# EAGLE board stm32H7_board_rev8_144_16 (EAGLE 6.5.0), part 1 of 2
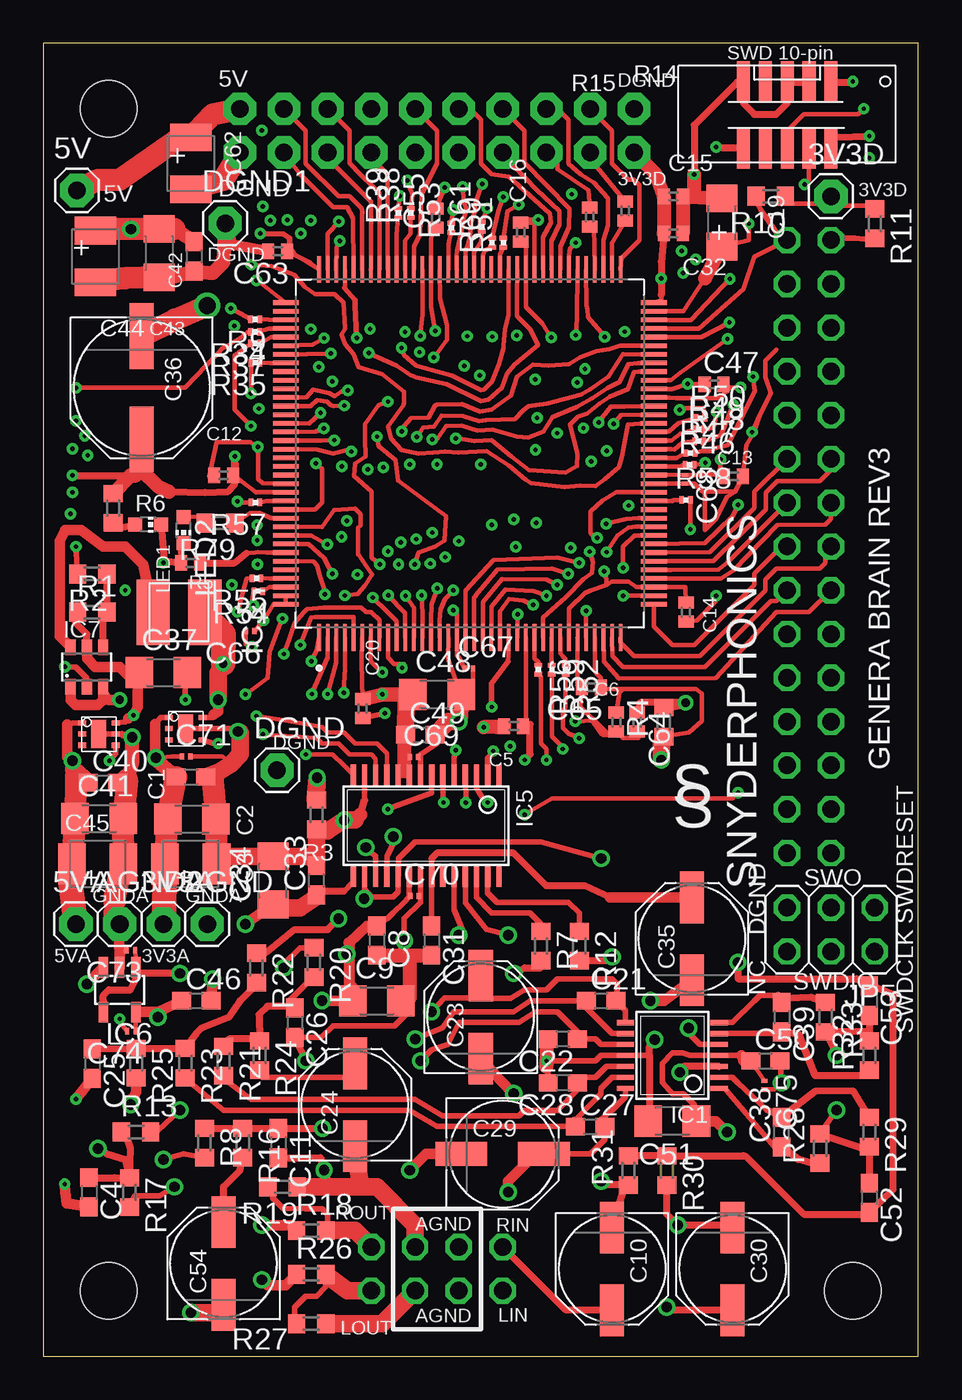
[diagram p1: board, top side]
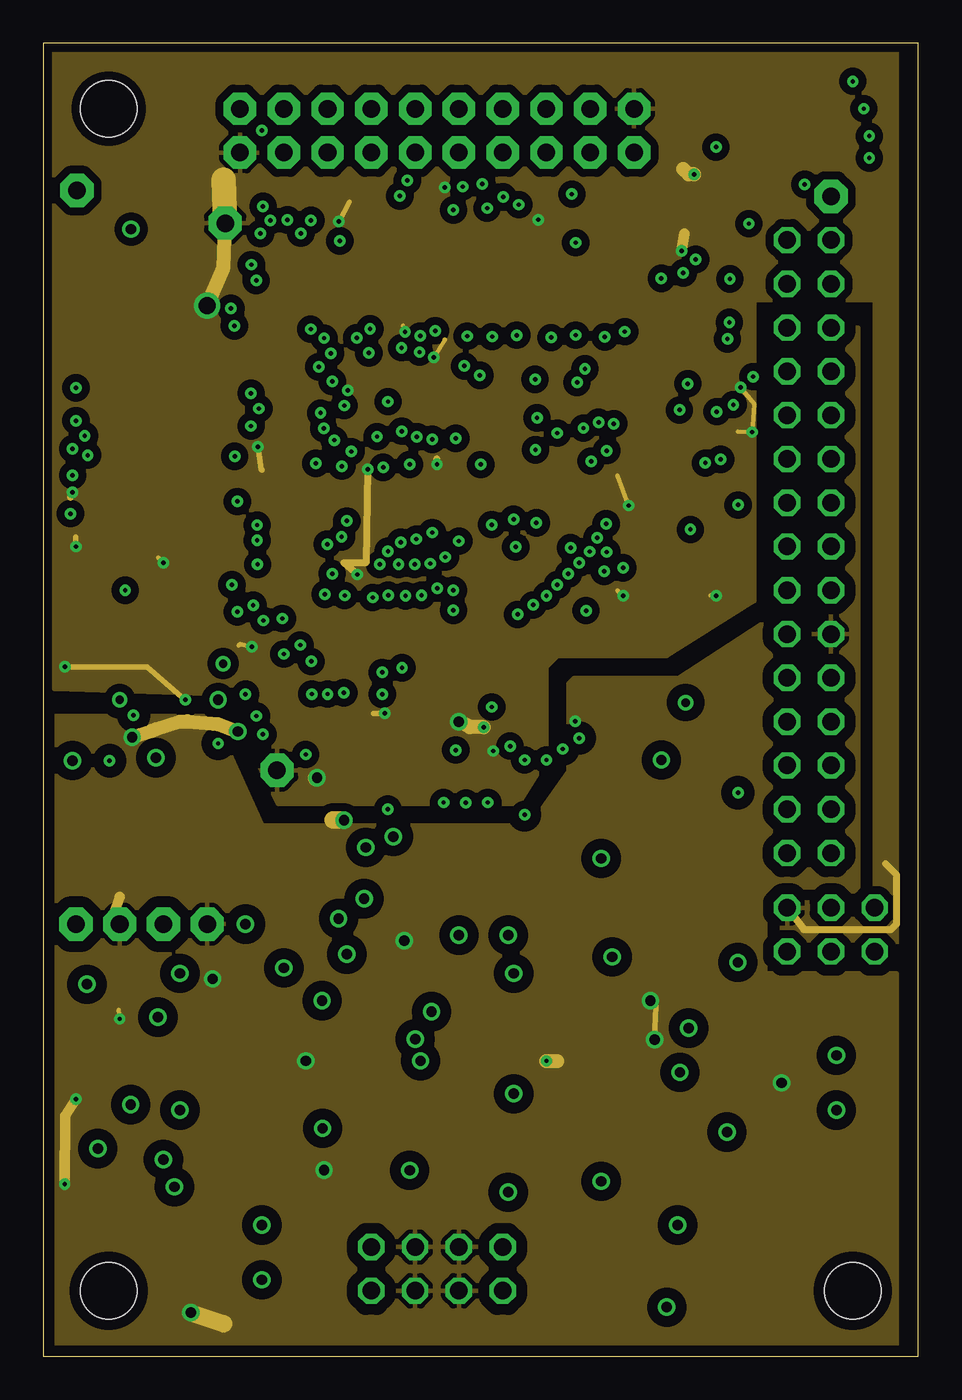
[diagram p2: board, inner layer Route2]
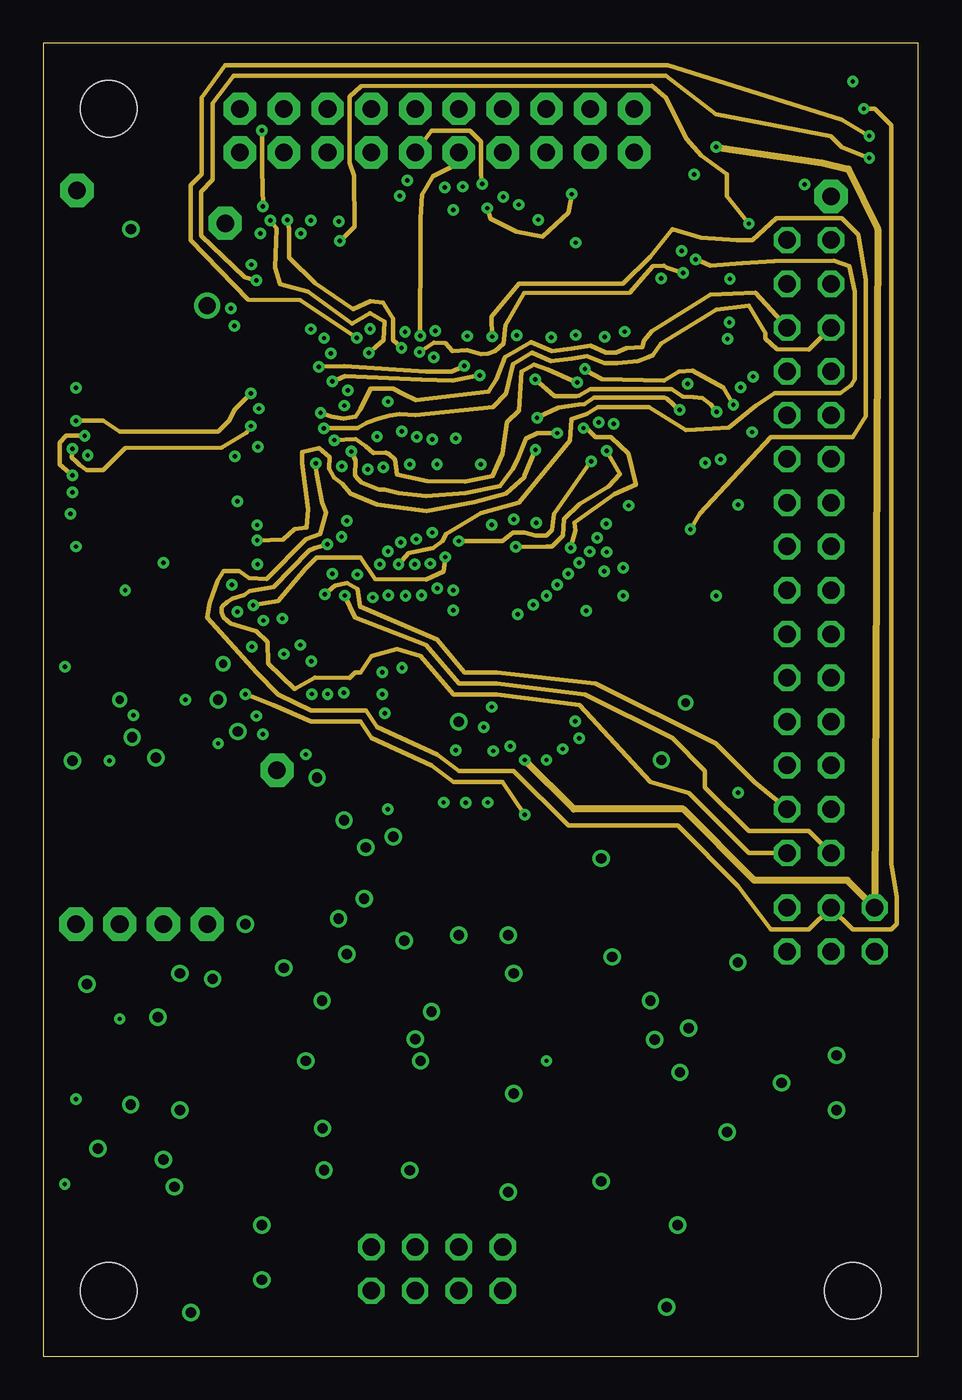
[diagram p3: board, inner layer Route3]
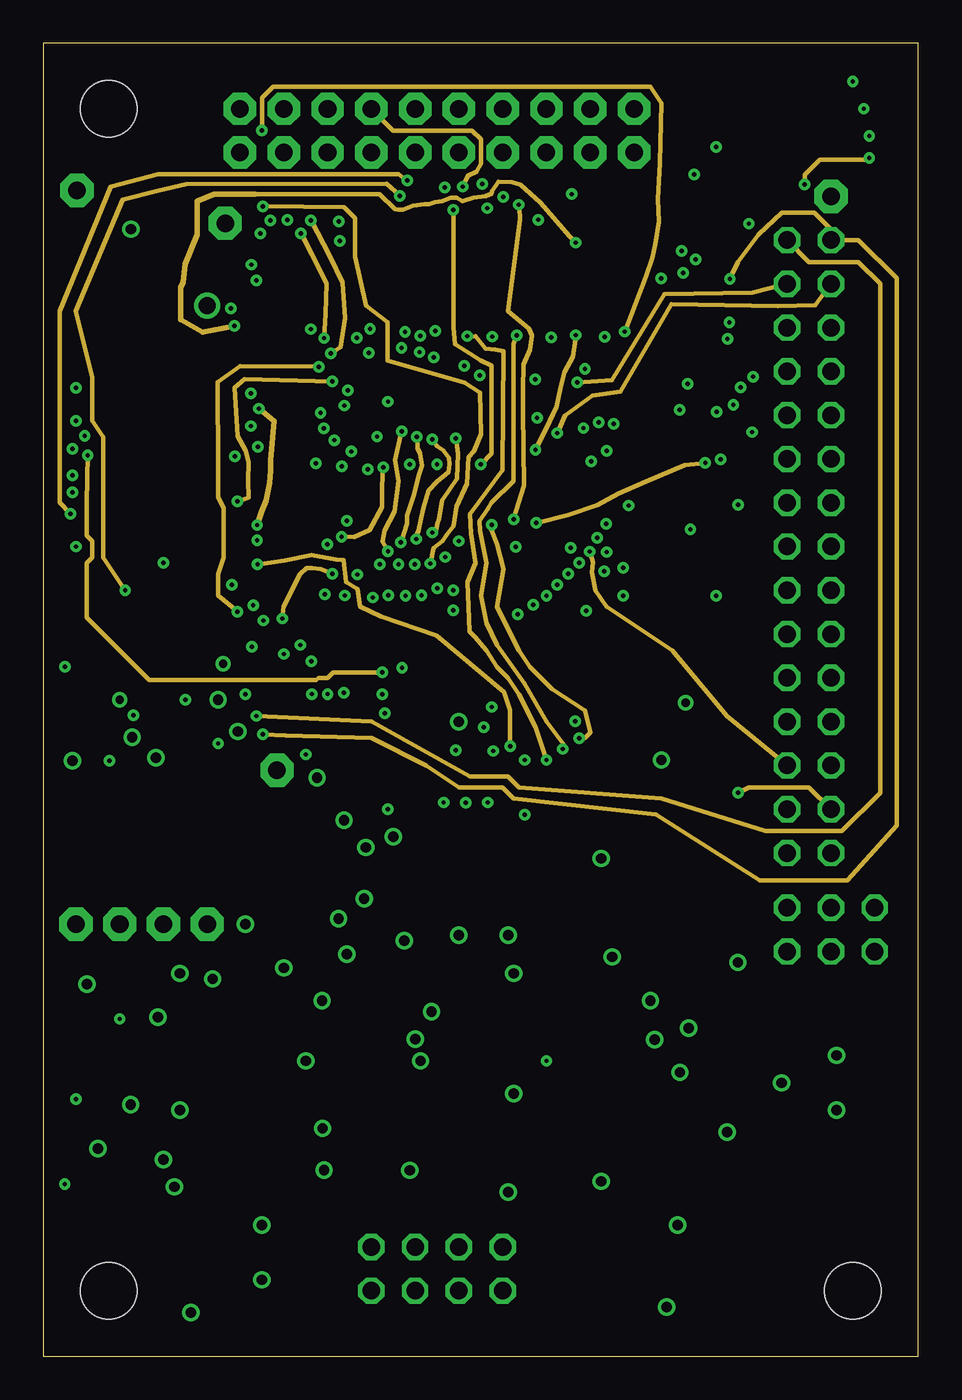
[diagram p4: board, inner layer Route14]
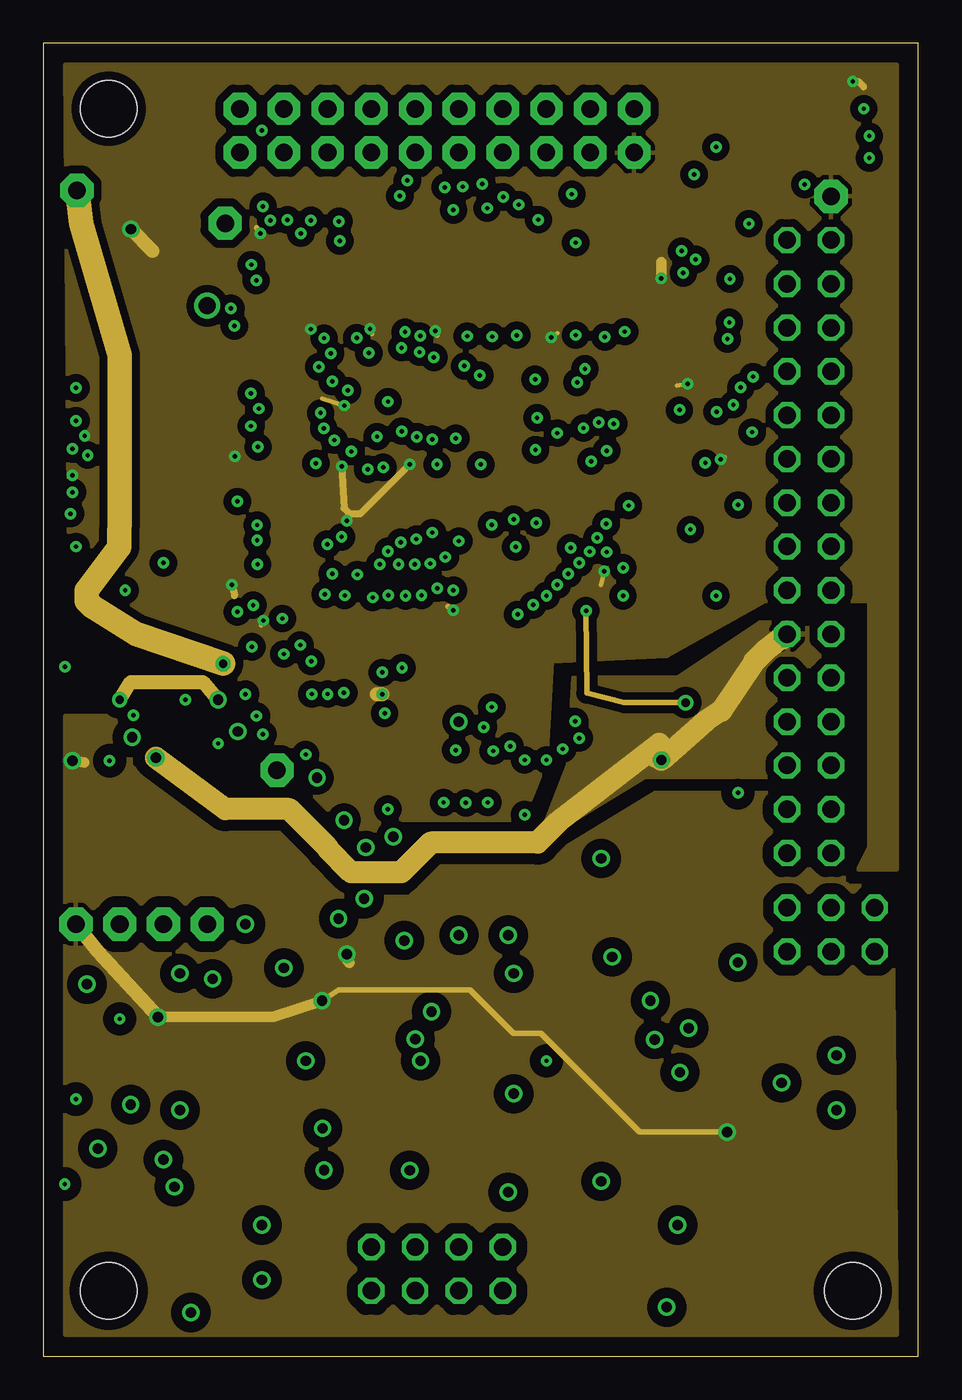
[diagram p5: board, inner layer Route15]
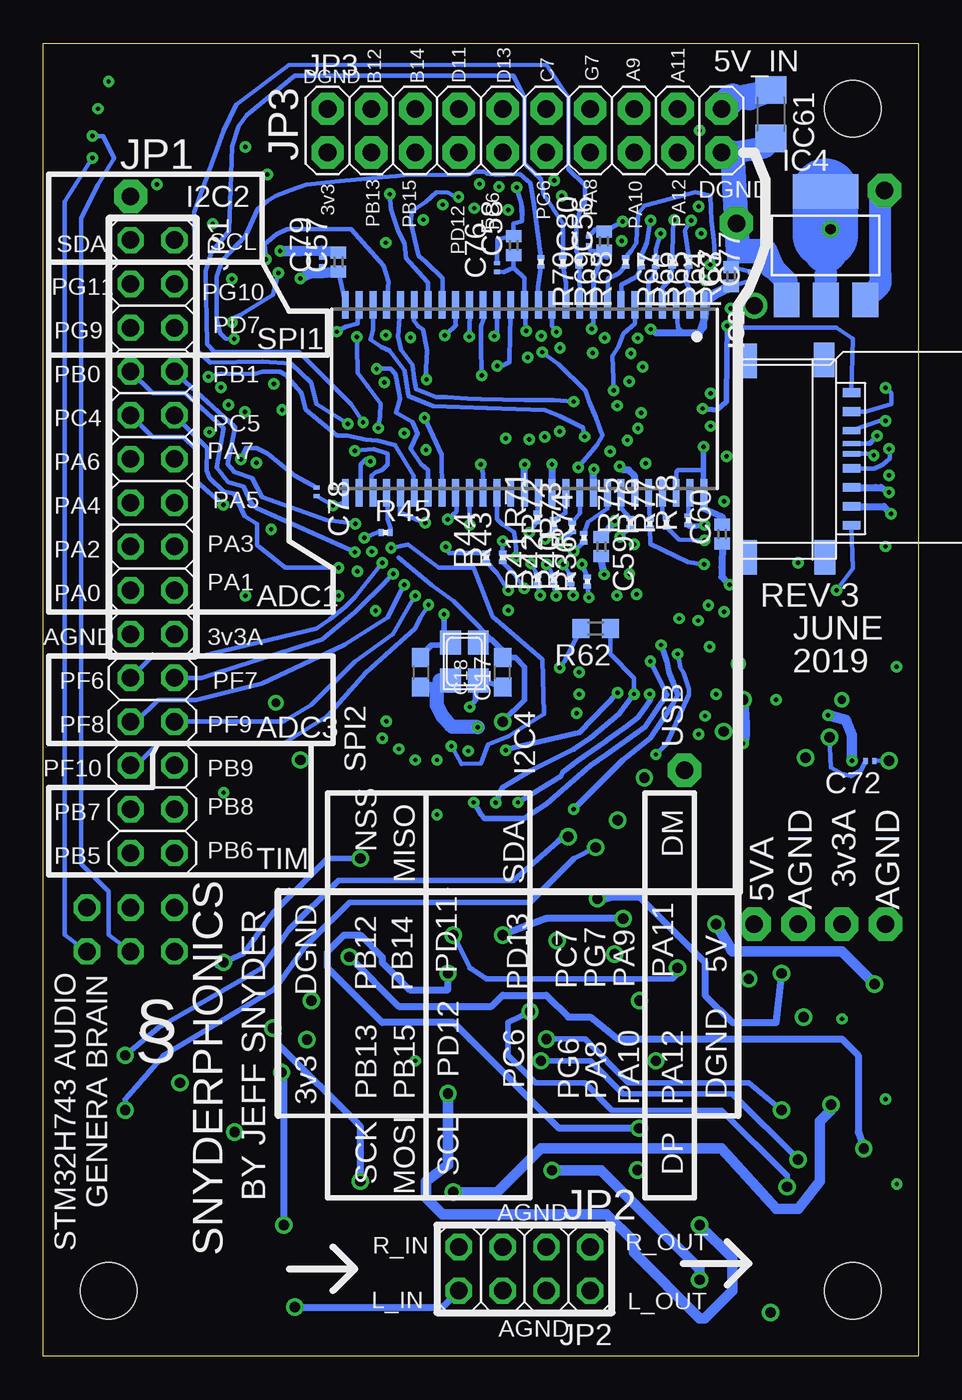
[diagram p6: board, bottom side, seen from below]

Size 50.8 x 76.2 mm. Coordinates in mm from the lower left corner, seen from the top.
Outline: 0,0 50.8,0 50.8,76.2 0,76.2 0,0
Copper layers (1+2+3*14+15+16): Top 0.035mm / dielectric 1mm / Route2 0.035mm / dielectric 1mm / Route3 0.035mm / dielectric 0.2mm / Route14 0.035mm / dielectric 0.15mm / Route15 0.035mm / dielectric 1mm / Bottom 0.035mm
Design rules "default *": minimum track width 9mil, minimum drill 9mil, track to track 9mil, track to pad 8mil, pad to pad 8mil, via to via 9mil, smd to smd 7mil, copper to edge 20mil, drill to drill 10mil, minimum pad ring 10mil, minimum via ring 8mil, stop-mask expansion 3mil, vias tented up to drill 0mil, thermal gap 10mil
Holes 3.26 mm at 3.81,72.39 46.99,3.81 3.81,3.81
Milling: 4 lines

## Footprints (pad centres in the part's own frame; a part is rotated, then mirrored left to right if it is on the bottom)
1X01 = drill 1.016 pad 1.93 octagon: 1 0,0
C0603 = smd 1.1 x 1: 1 -0.85,0; 2 0.85,0
C1206 = smd 1.6 x 1.8: 1 -1.4,0; 2 1.4,0
SMC_B = smd 1.6 x 2.4: + -1.5,0; - 1.5,0
C0402 = smd 0.7 x 0.9: 1 -0.55,0; 2 0.55,0
PANASONIC_D = smd 3 x 1.4: + 2.4,0; - -2.4,0
PANASONIC_E = smd 3.8 x 1.4: + 3,0; - -3,0
C0201 = smd 0.25 x 0.35: 1 -0.25,0; 2 0.25,0
TSSOP14 = smd 0.305 x 0.991: 1 -1.905,-2.718; 2 -1.27,-2.718; 3 -0.635,-2.718; 4 0,-2.718; 5 0.635,-2.718; 6 1.27,-2.718; 7 1.905,-2.718; 8 1.905,2.718; 9 1.27,2.718; 10 0.635,2.718; 11 0,2.718; 12 -0.635,2.718; 13 -1.27,2.718; 14 -1.905,2.718
TSOP54 = smd 0.4 x 1.6: 1 -10.4,-5.45; 2 -9.6,-5.45; 3 -8.8,-5.45; 4 -8,-5.45; 5 -7.2,-5.45; 6 -6.4,-5.45; 7 -5.6,-5.45; 8 -4.8,-5.45; 9 -4,-5.45; 10 -3.2,-5.45; 11 -2.4,-5.45; 12 -1.6,-5.45; 13 -0.8,-5.45; 14 0,-5.45; 15 0.8,-5.45; 16 1.6,-5.45; 17 2.4,-5.45; 18 3.2,-5.45; 19 4,-5.45; 20 4.8,-5.45; 21 5.6,-5.45; 22 6.4,-5.45; 23 7.2,-5.45; 24 8,-5.45; 25 8.8,-5.45; 26 9.6,-5.45; 27 10.4,-5.45; 28 10.4,5.45; 29 9.6,5.45; 30 8.8,5.45; 31 8,5.45; 32 7.2,5.45; 33 6.4,5.45; 34 5.6,5.45; 35 4.8,5.45; 36 4,5.45; 37 3.2,5.45; 38 2.4,5.45; 39 1.6,5.45; 40 0.8,5.45; 41 0,5.45; 42 -0.8,5.45; 43 -1.6,5.45; 44 -2.4,5.45; 45 -3.2,5.45; 46 -4,5.45; 47 -4.8,5.45; 48 -5.6,5.45; 49 -6.4,5.45; 50 -7.2,5.45; 51 -8,5.45; 52 -8.8,5.45; 53 -9.6,5.45; 54 -10.4,5.45
QFP50P2200X2200X160-144N = smd 1.56 x 0.28: 1 -10.68,8.75; 2 -10.68,8.25; 3 -10.68,7.75; 4 -10.68,7.25; 5 -10.68,6.75; 6 -10.68,6.25; 7 -10.68,5.75; 8 -10.68,5.25; 9 -10.68,4.75; 10 -10.68,4.25; 11 -10.68,3.75; 12 -10.68,3.25; 13 -10.68,2.75; 14 -10.68,2.25; 15 -10.68,1.75; 16 -10.68,1.25; 17 -10.68,0.75; 18 -10.68,0.25; 19 -10.68,-0.25; 20 -10.68,-0.75; 21 -10.68,-1.25; 22 -10.68,-1.75; 23 -10.68,-2.25; 24 -10.68,-2.75; 25 -10.68,-3.25; 26 -10.68,-3.75; 27 -10.68,-4.25; 28 -10.68,-4.75; 29 -10.68,-5.25; 30 -10.68,-5.75; 31 -10.68,-6.25; 32 -10.68,-6.75; 33 -10.68,-7.25; 34 -10.68,-7.75; 35 -10.68,-8.25; 36 -10.68,-8.75; 73 10.68,-8.75; 74 10.68,-8.25; 75 10.68,-7.75; 76 10.68,-7.25; 77 10.68,-6.75; 78 10.68,-6.25; 79 10.68,-5.75; 80 10.68,-5.25; 81 10.68,-4.75; 82 10.68,-4.25; 83 10.68,-3.75; 84 10.68,-3.25; 85 10.68,-2.75; 86 10.68,-2.25; 87 10.68,-1.75; 88 10.68,-1.25; 89 10.68,-0.75; 90 10.68,-0.25; 91 10.68,0.25; 92 10.68,0.75; 93 10.68,1.25; 94 10.68,1.75; 95 10.68,2.25; 96 10.68,2.75; 97 10.68,3.25; 98 10.68,3.75; 99 10.68,4.25; 100 10.68,4.75; 101 10.68,5.25; 102 10.68,5.75; 103 10.68,6.25; 104 10.68,6.75; 105 10.68,7.25; 106 10.68,7.75; 107 10.68,8.25; 108 10.68,8.75 | smd 0.28 x 1.56: 37 -8.75,-10.68; 38 -8.25,-10.68; 39 -7.75,-10.68; 40 -7.25,-10.68; 41 -6.75,-10.68; 42 -6.25,-10.68; 43 -5.75,-10.68; 44 -5.25,-10.68; 45 -4.75,-10.68; 46 -4.25,-10.68; 47 -3.75,-10.68; 48 -3.25,-10.68; 49 -2.75,-10.68; 50 -2.25,-10.68; 51 -1.75,-10.68; 52 -1.25,-10.68; 53 -0.75,-10.68; 54 -0.25,-10.68; 55 0.25,-10.68; 56 0.75,-10.68; 57 1.25,-10.68; 58 1.75,-10.68; 59 2.25,-10.68; 60 2.75,-10.68; 61 3.25,-10.68; 62 3.75,-10.68; 63 4.25,-10.68; 64 4.75,-10.68; 65 5.25,-10.68; 66 5.75,-10.68; 67 6.25,-10.68; 68 6.75,-10.68; 69 7.25,-10.68; 70 7.75,-10.68; 71 8.25,-10.68; 72 8.75,-10.68; 109 8.75,10.68; 110 8.25,10.68; 111 7.75,10.68; 112 7.25,10.68; 113 6.75,10.68; 114 6.25,10.68; 115 5.75,10.68; 116 5.25,10.68; 117 4.75,10.68; 118 4.25,10.68; 119 3.75,10.68; 120 3.25,10.68; 121 2.75,10.68; 122 2.25,10.68; 123 1.75,10.68; 124 1.25,10.68; 125 0.75,10.68; 126 0.25,10.68; 127 -0.25,10.68; 128 -0.75,10.68; 129 -1.25,10.68; 130 -1.75,10.68; 131 -2.25,10.68; 132 -2.75,10.68; 133 -3.25,10.68; 134 -3.75,10.68; 135 -4.25,10.68; 136 -4.75,10.68; 137 -5.25,10.68; 138 -5.75,10.68; 139 -6.25,10.68; 140 -6.75,10.68; 141 -7.25,10.68; 142 -7.75,10.68; 143 -8.25,10.68; 144 -8.75,10.68
SOT223 = smd 1.499 x 2.007: 1 -2.261,-3.15; 2 0.025,-3.15; 3 2.311,-3.15 | smd 3.81 x 2.007: PAD 0,3.15
TSSOP28 = smd 0.305 x 1.27: 1 -4.225,-2.918; 2 -3.575,-2.918; 3 -2.925,-2.918; 4 -2.275,-2.918; 5 -1.625,-2.918; 6 -0.975,-2.918; 7 -0.325,-2.918; 8 0.325,-2.918; 9 0.975,-2.918; 10 1.625,-2.918; 11 2.275,-2.918; 12 2.925,-2.918; 13 3.575,-2.918; 14 4.225,-2.918; 15 4.225,2.918; 16 3.575,2.918; 17 2.925,2.918; 18 2.275,2.918; 19 1.625,2.918; 20 0.975,2.918; 21 0.325,2.918; 22 -0.325,2.918; 23 -0.975,2.918; 24 -1.625,2.918; 25 -2.275,2.918; 26 -2.925,2.918; 27 -3.575,2.918; 28 -4.225,2.918
SOT23-5L = smd 0.55 x 1.2: 1 -0.95,-1.3; 2 0,-1.3; 3 0.95,-1.3; 4 0.95,1.3; 5 -0.95,1.3
SOT23-6 = smd 0.6 x 0.9: 1 -0.95,-1.15; 2 0,-1.15; 3 0.95,-1.15; 4 0.95,1.15; 5 0,1.15; 6 -0.95,1.15
6-WSON = smd 0.45 x 0.3: 1 -0.975,0.65; 2 -0.975,0; 3 -0.975,-0.65; 4 0.975,-0.65; 5 0.975,0; 6 0.975,0.65 | smd 0.9 x 1.6: PAD 0,0
2X15 = drill 1.016 octagon: 1 -17.78,-1.27; 2 -17.78,1.27; 3 -15.24,-1.27; 4 -15.24,1.27; 5 -12.7,-1.27; 6 -12.7,1.27; 7 -10.16,-1.27; 8 -10.16,1.27; 9 -7.62,-1.27; 10 -7.62,1.27; 11 -5.08,-1.27; 12 -5.08,1.27; 13 -2.54,-1.27; 14 -2.54,1.27; 15 0,-1.27; 16 0,1.27; 17 2.54,-1.27; 18 2.54,1.27; 19 5.08,-1.27; 20 5.08,1.27; 21 7.62,-1.27; 22 7.62,1.27; 23 10.16,-1.27; 24 10.16,1.27; 25 12.7,-1.27; 26 12.7,1.27; 27 15.24,-1.27; 28 15.24,1.27; 29 17.78,-1.27; 30 17.78,1.27
2X04 = drill 1.016 octagon: 1 -3.81,-1.27; 2 -3.81,1.27; 3 -1.27,-1.27; 4 -1.27,1.27; 5 1.27,-1.27; 6 1.27,1.27; 7 3.81,-1.27; 8 3.81,1.27
2X10 = drill 1.016 pad 1.88 octagon: 1 -11.43,-1.27; 2 -11.43,1.27; 3 -8.89,-1.27; 4 -8.89,1.27; 5 -6.35,-1.27; 6 -6.35,1.27; 7 -3.81,-1.27; 8 -3.81,1.27; 9 -1.27,-1.27; 10 -1.27,1.27; 11 1.27,-1.27; 12 1.27,1.27; 13 3.81,-1.27; 14 3.81,1.27; 15 6.35,-1.27; 16 6.35,1.27; 17 8.89,-1.27; 18 8.89,1.27; 19 11.43,-1.27; 20 11.43,1.27
2X03 = drill 1.016 octagon: 1 -2.54,-1.27; 2 -2.54,1.27; 3 0,-1.27; 4 0,1.27; 5 2.54,-1.27; 6 2.54,1.27
1212 = smd 1.93 x 3.81: P$1 1.5,0; P$2 -1.5,0
CHIP-LED0603 = smd 0.8 x 0.8: A 0,-0.75; C 0,0.75
NX3225 = smd 1.4 x 1.2: 1 -1.1,-0.8; 2 1.1,-0.8; 3 1.1,0.8; 4 -1.1,0.8
R0603 = smd 1 x 1.1: 1 -0.85,0; 2 0.85,0
R0402 = smd 0.7 x 0.9: 1 -0.55,0; 2 0.55,0
R0201 = smd 0.28 x 0.43: 1 -0.255,0; 2 0.255,0
1050270001 = smd 0.5 x 1: P1 3.85,-3.1; P2 2.75,-3.1; P5 -0.55,-3.1; P6 -1.65,-3.1; P7 -2.75,-3.1; P8 -3.85,-3.1 | smd 0.4 x 1: P3 1.65,-3.1 | smd 0.3 x 1: P4 0.9,-3.1; SWITCH 0.3,-3.1 | smd 2 x 1.2: P$1 5.7,3; P$2 -5.7,3; P$3 -5.7,-1.55; P$4 5.75,-1.5
3221-10-0300-00 = smd 0.76 x 2.4: 1 -2.54,-1.87; 2 -2.54,1.97; 3 -1.27,-1.87; 4 -1.27,1.97; 5 0,-1.87; 6 0,1.97; 7 1.27,-1.87; 8 1.27,1.97; 9 2.54,-1.87; 10 2.54,1.97

## Placement (x,y rotation side)
3V3A  [1X01]  6.99,25.08 0 top
3V3D  [1X01]  45.72,67.31 0 top
5V  [1X01]  1.97,67.65 0 top
5VA  [1X01]  1.91,25.08 0 top
AGND  [1X01]  9.53,25.08 0 top
AGND2  [1X01]  4.45,25.08 0 top
C1  .1uf  [C0603]  8.59,33.62 0 top
C2  1uf  [C1206]  8.64,31.18 0 top
C3  10uf  [SMC_B]  8.57,28.57 0 top
C4  2200pf  [C0603]  2.67,9.53 270 top
C5  .1uf  [C0402]  27.3,36.58 180 top
C6  .1uf  [C0402]  33.27,36.8 270 top
C7  .1uf  [C0402]  10.87,62.66 90 bottom
C8  .1uf  [C0603]  19.37,24.13 270 top
C9  1uf  [C1206]  19.37,20.64 0 top
C10  22uf  [PANASONIC_D]  33.02,5.08 270 top
C11  6.8nf  [C0603]  13.65,12.38 270 top
C12  .1uf  [C0402]  10.48,51.12 180 top
C13  .1uf  [C0402]  40.06,51.07 0 top
C14  .1uf  [C0402]  37.31,43.18 270 top
C15  .1uf  [C0402]  36.58,67.31 0 top
C16  .1uf  [C0402]  27.71,65.23 90 top
C17  18pf  [C0603]  24.13,39.69 90 bottom
C18  18pf  [C0603]  28.89,39.69 270 bottom
C19  2.2uf  [C1206]  39.4,65.79 90 top
C20  .1uf  [C0402]  18.54,37.59 270 top
C21  470pf  [C0603]  32.38,20.64 0 top
C22  1.5nf  [C0603]  30.16,18.41 180 top
C23  22uf  [PANASONIC_D]  25.4,19.68 90 top
C24  22uf  [PANASONIC_D]  18.1,14.61 90 top
C25  2200pf  [C0603]  2.86,16.99 270 top
C26  6.8nf  [C0603]  14.61,19.37 270 top
C27  470pf  [C0603]  31.75,13.34 0 top
C28  1.5nf  [C0603]  30.16,15.88 180 top
C29  22uf  [PANASONIC_D]  26.67,11.75 0 top
C30  22uf  [PANASONIC_D]  40.01,5.08 270 top
C31  .1uf  [C0603]  22.54,24.13 270 top
C32  .01uf  [C0402]  36.58,65.15 0 top
C33  .1uf  [C0603]  15.88,27.62 90 top
C34  1uf  [C1206]  13.34,27.62 90 top
C35  47uf  [PANASONIC_D]  37.66,24.23 90 top
C36  100uf  [PANASONIC_E]  5.71,56.2 270 top
C37  1uf  [C1206]  6.99,39.69 0 top
C38  470pf  [C0603]  42.86,13.02 90 top
C39  470pf  [C0603]  42.86,19.68 270 top
C40  .1uf  [C0603]  3.47,33.29 0 top
C41  1uf  [C1206]  3.25,31.2 0 top
C42  .1uf  [C0603]  8.76,63.82 270 top
C43  1uf  [C1206]  6.73,64.01 270 top
C44  10uf  [SMC_B]  3.05,63.82 270 top
C45  10uf  [SMC_B]  3.17,28.57 0 top
C46  .1uf  [C0603]  8.89,20.64 0 top
C47  .1uf  [C0402]  38.94,56.4 0 top
C48  1uf  [C1206]  22.86,38.42 0 top
C49  .1uf  [C0603]  21.88,36.07 0 top
C50  .1uf  [C0603]  41.91,17.14 0 top
C51  1uf  [C1206]  36.51,13.65 180 top
C52  2700pf  [C0603]  47.94,9.21 270 top
C53  2700pf  [C0603]  47.94,20.64 270 top
C54  22uf  [PANASONIC_D]  10.48,5.4 90 top
C55  .1uf  [C0402]  22.78,66.04 90 top
C56  .1uf  [C0402]  18.25,64.71 90 bottom
C57  .1uf  [C0402]  33.66,63.5 90 bottom
C58  .1uf  [C0402]  23.5,64.45 90 bottom
C59  .1uf  [C0402]  18.4,46.98 270 bottom
C60  .1uf  [C0402]  11.39,47.71 90 bottom
C61  1uf  [C1206]  8.57,72.07 270 bottom
C62  10uf  [SMC_B]  8.57,69.22 270 top
C63  .1uf  [C0402]  13.61,64.12 180 top
C64  .01uf  [C0402]  34.48,36.8 270 top
C65  .01uf  [C0402]  31.83,38.82 180 top
C66  .01uf  [C0201]  12.01,42.09 180 top
C67  .01uf  [C0201]  24.7,39.9 0 top
C68  .01uf  [C0201]  37.24,50.89 270 top
C69  .01uf  [C0201]  21.53,34.77 0 top
C70  .01uf  [C0201]  21.55,26.72 0 top
C71  .01uf  [C0201]  8.31,34.8 0 top
C72  .01uf  [C0201]  2.82,34.56 180 bottom
C73  .01uf  [C0201]  5.09,23.57 180 top
C74  .01uf  [C0201]  5.13,18.87 180 top
C75  .01uf  [C0201]  41.86,15.74 270 top
C76  .01uf  [C0201]  24.45,63.18 90 bottom
C77  .01uf  [C0201]  9.72,62.67 90 bottom
C78  .01uf  [C0201]  34.92,50.16 270 bottom
C79  .01uf  [C0201]  34.61,63.5 90 bottom
C80  .01uf  [C0201]  19.13,64.72 90 bottom
DGND  [1X01]  13.58,34.01 0 top
DGND1  [1X01]  10.57,65.75 0 top
IC1  OPA4344E  [TSSOP14]  36.51,17.46 90 top
IC2  AS4C32M16SB  [TSOP54]  22.86,55.56 180 bottom
IC3  STM32H743ZIT6  [QFP50P2200X2200X160-144N]  24.77,52.39 90 top
IC4  REG1117  [SOT223]  5.4,64.45 0 bottom
IC5  CS4271  [TSSOP28]  22.23,30.8 180 top
IC6  TLV170  [SOT23-5L]  4.45,21.27 180 top
IC7  TLV61046ADBVR  [SOT23-6]  2.54,40.01 0 top
IC8  LP5912  [6-WSON]  3.24,36.11 0 top
IC9  LP5912  [6-WSON]  8.28,36.42 0 top
JP1  [2X15]  44.45,46.99 270 bottom
JP2  [2X04]  22.86,5.08 180 bottom
JP3  [2X10]  22.86,71.12 0 bottom
JP5  [2X03]  45.72,24.77 180 top
L1  74438336100  [1212]  7.89,43.18 0 top
LED1  RED  [CHIP-LED0603]  6.1,48.26 270 top
LED2  GREEN  [CHIP-LED0603]  8.15,47.94 180 top
Q1  25MHz  [NX3225]  26.35,40.32 90 bottom
R1  30.9k  [R0603]  2.86,43.18 0 top
R2  4.7k  [R0603]  2.86,45.4 180 top
R3  0R  [R0603]  15.88,31.43 270 top
R4  47R  [R0603]  36.02,36.8 90 top
R5  10k  [R0402]  8.57,46.04 180 top
R6  560R  [R0603]  4.06,49.21 270 top
R7  1.33k  [R0603]  28.89,23.81 270 top
R8  715R  [R0603]  9.37,12.38 270 top
R9  68R  [R0201]  12.31,60.17 180 top
R10  2k7  [R0603]  42.23,67.31 180 top
R11  2k7  [R0603]  48.26,65.72 270 top
R12  4.42k  [R0603]  31.11,23.81 270 top
R13  2.32k  [R0603]  5.4,13.02 0 top
R14  33R  [R0402]  33.78,66.45 270 top
R15  33R  [R0402]  31.72,66.11 270 top
R16  1.5k  [R0603]  11.59,12.38 270 top
R17  4.99k  [R0603]  5.02,9.51 270 top
R18  560R  [R0603]  15.56,7.3 0 top
R19  47k  [R0603]  13.89,9.84 180 top
R20  1.33k  [R0603]  15.72,22.86 270 top
R21  715R  [R0603]  10.48,17.14 270 top
R22  4.42k  [R0603]  12.38,22.54 270 top
R23  2.32k  [R0603]  8.26,17.02 270 top
R24  1.5k  [R0603]  12.56,17.46 270 top
R25  4.99k  [R0603]  5.4,17.02 270 top
R26  560R  [R0603]  15.56,4.76 0 top
R27  47k  [R0603]  15.56,1.91 180 top
R28  91R  [R0603]  45.09,12.06 90 top
R29  634R  [R0603]  47.94,13.02 270 top
R30  10k  [R0603]  36.2,10.79 270 top
R31  10k  [R0603]  33.97,10.79 90 top
R32  634R  [R0603]  47.94,17.46 90 top
R33  91R  [R0603]  45.4,19.68 270 top
R34  68R  [R0201]  12.29,59.45 180 top
R35  68R  [R0201]  12.32,57.66 180 top
R36  33R  [R0201]  19.22,44.96 90 bottom
R37  68R  [R0201]  12.31,58.78 180 top
R38  68R  [R0201]  21.34,66.34 90 top
R39  68R  [R0201]  20.61,66.34 90 top
R40  33R  [R0201]  20.19,45.09 90 bottom
R41  33R  [R0201]  22.1,45.09 90 bottom
R42  33R  [R0201]  21.17,45.06 90 bottom
R43  33R  [R0201]  24.13,46.35 90 bottom
R44  33R  [R0201]  25.08,46.35 90 bottom
R45  33R  [R0201]  30.92,47.8 0 bottom
R46  33R  [R0201]  37.52,51.73 0 top
R47  33R  [R0201]  37.57,52.41 0 top
R48  33R  [R0201]  38.06,53.1 0 top
R49  33R  [R0201]  38.06,53.78 0 top
R50  33R  [R0201]  38.15,54.44 0 top
R51  33R  [R0201]  26.71,64.62 90 top
R52  33R  [R0201]  30.32,39.85 270 top
R53  33R  [R0201]  23.69,65.49 90 top
R54  33R  [R0201]  12.48,44.4 180 top
R55  33R  [R0201]  12.38,45.15 180 top
R56  33R  [R0201]  28.73,39.85 270 top
R57  33R  [R0201]  12.32,49.55 180 top
R58  33R  [R0201]  37.31,49.69 0 top
R59  33R  [R0201]  29.53,39.85 270 top
R60  33R  [R0201]  26.05,64.62 90 top
R61  33R  [R0201]  25.46,65.54 90 top
R62  0R  [R0603]  18.73,42.23 180 bottom
R63  33R  [R0201]  13.34,63.5 270 bottom
R64  33R  [R0201]  14.29,63.5 270 bottom
R65  33R  [R0201]  15.24,63.5 270 bottom
R66  33R  [R0201]  16.09,63.47 270 bottom
R67  33R  [R0201]  16.99,63.5 270 bottom
R68  33R  [R0201]  19.68,63.5 270 bottom
R69  33R  [R0201]  20.64,63.5 270 bottom
R70  33R  [R0201]  21.91,63.5 270 bottom
R71  33R  [R0201]  22.12,48.68 90 bottom
R72  33R  [R0201]  21.16,48.31 90 bottom
R73  33R  [R0201]  20.1,48.09 90 bottom
R74  33R  [R0201]  19.42,47.5 90 bottom
R75  33R  [R0201]  16.73,48.36 90 bottom
R76  33R  [R0201]  15.58,48.31 90 bottom
R77  33R  [R0201]  14.63,48.36 90 bottom
R78  33R  [R0201]  13.36,48.51 90 bottom
R79  560R  [R0603]  10.27,48.35 180 top
X1  1050270001_SD_CARD_CONNECTOR  [1050270001]  6.99,52.07 90 bottom
X2  3221-10-0300-00  [3221-10-0300-00]  43.18,72.07 180 top

## Tracks (layer width: path | path; a pad name or v marks a point on that pad's centre or on a via)
3V3A  (via drill 0.6)
  Top 0.254: IC3.33 32.02,39.95 32.12,39.64 32.38,39.37 32.38,38.84 C65.1 32.49,38.73 33.66,38.73 | R4.1 37.48,36.21 38.23,36.88 38.23,38.47 37.88,38.73 33.97,38.73 33.66,38.73 | C6.1 33.45,38.52 33.66,38.73 | C71.1 7.47,34.8 v6.55,34.73
  Top 0.305: IC9.1 6.83,37.08 6.5,36.7
  Top 0.61: 6.5,36.7 6.5,35.31 v6.55,34.73
  Top 0.813: C1.1 6.48,34.67 v6.55,34.73
  Top 1.016: v35.88,34.61 35.88,35.24 35.88,35.56 35.99,35.67 R4.1
  Top 1.27: C3.+ C2.1 C1.1
  Top 1.422: C3.+ 3V3A.1
  Route15 1.016: 35.53,34.8 v35.88,34.61
  Route15 1.27: v6.55,34.73 10.57,31.75 14.29,31.75 16.51,29.53 16.51,29.46 17.88,28.09 20.78,28.09 22.5,29.82 28.7,29.82 29.91,31.03 35.75,35.55 35.53,34.8 v35.88,34.61 38.42,36.83 39.37,37.47 41.27,40.32 41.91,40.96 41.91,40.97 43.26,42 42.95,41.68 JP1.20
  pour Route15 (isolate 0.457): 46.67,42.23 43.18,42.23 43.18,42.55 41.59,42.55 36.83,39.37 30.8,39.37 30.48,34.29 28.89,30.16 29.21,30.16 34.92,33.66 46.67,33.66
5V0  (via drill 0.6)
  Top 0.254: 21.25,26.65 21.25,26.67 C70.1 | IC6.5 C74.1 | C50.1 C75.1
  Top 0.305: 40.53,17.46 IC1.4 37.53,17.48 37.1,17.61 36.51,17.61 35.93,17 | IC5.20 21.25,26.65 20.95,26.35 20.32,25.72 20,25.4 C8.1 | 35.93,17 35.93,15.9 | 35.93,15.9 36.51,15.24 | 36.51,15.24 37.15,15.24 | 37.15,15.24 37.78,14.61 | 37.78,14.61 37.78,13.65 | 37.78,13.65 37.78,13.46 C51.1 | 35.93,17 35.93,15.9 | 35.93,15.9 36.51,15.24 | 36.51,15.24 37.15,15.24 | 37.15,15.24 37.78,14.61 | 37.78,14.61 37.78,13.65 | IC8.1 1.73,36.75 1.4,36.65
  Top 0.406: C50.1 40.64,17.14
  Top 0.61: 40.64,17.14 40.53,17.46 | C8.1 18.81,24.98 17.75,24 | 37.78,13.65 39.05,13.65 v39.69,13.02 | v16.19,20.64 C9.1 | v6.67,19.68 6.67,20 | 6.67,20 C46.1 6.67,20 | 6.67,20 5.4,20 5.42,20 IC6.5 | 1.79,34.06 1.78,34.29 v1.7,34.57 | v1.7,34.57 1.65,34.67 | 1.4,36.65 1.4,34.77 v1.7,34.57
  Top 0.635: 17.75,24 17.75,23.47 v17.62,23.34 | C9.1 17.97,21.4 17.78,21.59 17.78,23.18
  Top 0.813: 17.78,20.51 C9.1 | C45.+ 1.62,27.94 1.59,27.62
  Top 1.016: 1.91,33.66 C40.1 1.79,34.06
  Top 1.27: 1.91,33.66 C41.1 1.62,27.94
  Top 1.422: 1.59,27.62 1.68,26.92 5VA.1
  Route15 0.305: v39.69,13.02 34.61,13.02 28.89,18.73 27.3,18.73 24.77,21.27 17.14,21.27 v16.19,20.64
  Route15 0.61: v16.19,20.64 13.34,19.68 v6.67,19.68 | v1.7,34.57 2.39,34.47
  Route15 0.635: v17.62,23.34 17.62,23.02 17.78,22.86
  Route15 0.813: 1.91,25.09 3.17,23.5 v6.67,19.68
  Bottom 0.254: C72.1 v1.7,34.57
  pour Route15 (isolate 0.635, rank 2): 1.27,1.27 1.27,37.15 5.08,37.15 5.08,34.29 10.26,30.42 13.75,30.42 17.46,26.67 21.27,26.67 23.18,28.57 29.21,28.57 31.11,30.16 34.92,32.7 45.72,32.7 45.72,29.53 46.67,27.3 49.21,27.3 49.31,26.35 49.31,24.43 49.53,1.27
12V0  (via drill 0.25)
  Top 0.305: 5.5,39.16 C37.1 5.08,39.37 | IC8.6 4.78,36.8 4.93,37.01 | IC8.4 4.22,34.98 v3.86,34.57 | v5.25,37.2 5.5,37.68
  Top 0.406: IC7.5 2.54,41.91 1.91,42.55 1.91,43.08 R1.1
  Top 0.61: 5.5,39.16 5.5,37.68 v5.25,37.2 4.93,37.01 | 5.08,39.37 4.45,40.01 3.04,40.01 2.56,40.5 IC7.5
  Bottom 0.61: v3.86,34.57 3.86,36.04 4.21,36.93 v5.25,37.2
+3V3  (via drill 0.25, 0.6)
  Top 0.254: C20.1 18.49,40.28 IC3.6 | C14.1 37.29,44.64 IC3.39 35.44,44.63 34.44,44.63 33.97,44.97 33.01,44.97 32.7,44.77 | C13.1 38.94,51.16 IC3.52 38.1,51.15 | C55.1 22.86,65.41 22.54,65.09 22.52,64.74 IC3.95 22.52,60.9 v22.76,59.51 22.86,59.59 22.76,59.49 | 27.94,64.45 C16.1 27.69,64.45 27.94,64.45 | 27.94,64.45 28.02,64.38 IC3.84 | 35.88,61.59 35.88,61.28 IC3.72 | C47.1 37.36,56.43 | 37.36,56.43 36.51,56.13 36.5,56.13 | 36.5,56.13 35.47,56.13 | 35.47,56.13 IC3.62 | v23.81,43.29 24.02,43.09 IC3.17 24.02,40.68 24.13,40.56 C67.1 | IC3.30 30.52,43.38 31.43,44.3 31.75,44.45 32.7,44.77 | 32.7,44.77 32.7,45.09 v32.56,45.55 | 27.94,64.45 27.94,64.44 28.02,64.36 28.02,60.88 28.98,59.92 v29.48,59.12 | IC3.121 15.52,55.14 15.9,55.47 16.48,55.4 16.69,55.19 16.87,55.14 v17.48,55.17 | C12.1 12.37,50.14 IC3.131 12.36,50.11 11.11,51.12 11.14,51.83 11.11,50.58 | 35.47,56.13 36.5,56.13 | 36.5,56.13 37.36,56.43 | 37.36,56.43 v37.41,56.44 | 38.1,51.15 38.76,51.16 39.28,51.13 v39.32,52.05 | C63.1 15.49,63.45 IC3.108 14.55,63.96 | IC3.143 IC3.144 13.39,43.66 v12.79,42.7 12.66,42.57 12.64,42.57 12.54,42.38 C66.1 | R10.1 43.08,67.26 43.46,66.88 45.29,66.88 3V3D.1 46.25,66.78 48.26,66.78 | C68.1 38.09,51.14 38.1,51.15 | C69.1 21.12,34.77 20.95,34.61
  Top 0.305: 20.95,33.98 IC5.9 IC5.10 | 14.55,63.96 14.3,64.36 14.3,64.87 13.95,65.13 v12.61,65.15 | 48.26,66.67 R11.1 48.26,66.67
  Top 0.406: C32.1 35.88,63.5 v35.88,62.55 35.88,61.59 | R6.1 4.42,49.73 | 11.14,51.83 11.14,51.59 C12.1 | v1.71,51.12 4.76,51.12 5.64,51.68 | 48.26,66.78 R11.1 | v46.99,73.98 46.95,73.94 46.07,73.94 X2.1 | 7.3,50.16 9.4,50.13 10.74,50.19 11.11,50.58 11.11,51.75 v11.12,52.22
  Top 0.813: C49.1 20.95,35.56 20.95,34.61 20.95,33.98 | C48.1 20.64,38.42 | 20.64,38.42 v19.68,38.42 | C20.1 v19.68,38.42 | v19.68,38.42 20.64,38.42 | 20.64,38.42 v19.68,38.42 | C32.1 C15.1 35.56,68.58 JP3.1 | C42.1 7.62,65.41 | R6.1 5.08,51.12 5.4,51.12 5.64,51.47 | 5.64,51.47 5.64,51.68 C36.+ | C43.1 v5.11,65.41 | 5.64,51.47 6.67,50.48 7.3,50.16
  Top 1.016: C49.1 21.07,38.37 C48.1
  Top 1.27: C44.+ 4.13,65.41 C43.1 7.62,65.41
  Route3 0.254: v2.41,53.42 1.35,53.42 0.95,53.02 0.95,51.75 v1.71,51.12
  Route15 0.254: v12.79,42.7 12.66,42.42 | v32.56,45.55 32.38,44.77 | v29.48,59.12 29.84,59.37 | v17.48,55.17 16.19,55.56 | v37.41,56.44 36.78,56.34 | v39.32,52.05 39.56,52.18 | v18.97,59.61 19.1,59.31
  Route15 0.305: v23.81,43.29 23.5,43.5 | v12.61,65.15 12.39,65.48 | v22.76,59.51 22.86,59.26 22.71,59.49
  Route15 0.406: v17.63,48.48 17.78,48.9 | v17.34,51.65 17.46,49.21 17.78,48.9 | 17.78,48.9 18.41,48.9 v21.27,51.75 | v10.96,44.77 11.11,44.13 | v46.99,73.98 47.31,73.98 47.62,73.66 | v15.53,59.6 15.51,59.65 | v11.12,52.22 11.07,52.12
  Route15 0.61: v35.88,62.55 35.88,63.5
  Route15 0.813: v19.68,38.42 19.37,38.42 | v5.11,65.41 6.35,64.14
  Bottom 0.254: v2.4,53.42 2.81,52.96 X1.P4 2.91,52.97 2.86,53.02 2.81,53.02 v2.41,53.42 | v22.76,59.51 22.81,59.72 22.81,60.89 IC2.14 22.86,62.55 23.5,63.18 | C58.1 23.5,63.18 | IC2.9 18.82,62.61 C56.1 | IC2.3 13.97,59.69 13.65,59.37 12.7,59.37 12.38,59.69 IC2.1 | IC2.27 C57.1 | C56.1 18.82,62.56 18.92,61.29 18.87,59.84 v18.97,59.61 | C76.1 24.08,62.92 23.5,63.18 | C77.1 C7.1 | C78.1 36.2,51.12 37.78,52.39 38.42,52.7 39.05,52.7 v39.32,52.05 | C79.1 34.61,62.86 | C80.1 19.05,64.14 C56.1
  Bottom 0.305: C7.1 IC2.1
  Bottom 0.406: C59.1 v17.63,48.48 | IC2.49 16.46,51.07 16.83,51.44 17.14,51.44 v17.34,51.65 | v21.27,51.75 21.27,50.12 IC2.43 | C60.1 11.42,45.77 11.42,45.24 v10.96,44.77 | 12.24,61.42 12.38,60.33 12.7,59.37 15.24,59.37 v15.53,59.6 | C56.1 18.1,63.82
  Bottom 0.61: C7.1 12.24,61.42 | C57.1 34.61,62.86 35.24,62.87 v35.88,62.55
  Bottom 0.813: 5.37,62.52 5.4,64.14
  Bottom 1.016: 5.4,65.06 v5.11,65.41
  Bottom 1.27: 5.37,62.52 5.4,62.55 | 5.4,62.55 5.37,62.84 5.4,62.55 | 5.4,62.55 5.4,61.33 IC4.2
  Bottom 2.54: 5.4,64.14 v5.11,65.41
  Bottom 3.81: IC4.PAD 5.4,65.06
  pour Route15 (isolate 0.457): 1.59,38.73 1.59,38.42 1.91,38.1 5.4,38.1 6.03,37.47 6.67,36.51 7.3,35.88 11.43,33.02 15.24,33.02 18.73,29.53 18.73,29.21 20.64,31.11 27.62,31.11 27.94,31.43 29.21,34.61 29.53,40.32 36.2,40.64 41.91,43.81 47.94,43.81 47.94,29.53 47.31,28.26 49.53,28.26 49.53,74.93 1.27,74.93
+5V  (via drill 0.25, 0.48, 0.6)
  Top 0.254: IC9.4 9.84,35.56 v10.16,35.56
  Top 0.305: 10.16,38.15 v10.16,38.1 10.16,37.78 | IC7.3 3.49,38.42 | 9.91,37.24 9.83,37.08 IC9.6 | v10.16,35.56 9.8,35.59 IC9.4
  Top 0.61: v10.16,38.1 10.16,38.15 | 10.16,39.69 10.16,40.96 L1.P$1 | IC7.1 1.59,38.1 1.91,37.78 3.17,37.78 3.49,38.1 IC7.3 | 3.49,38.42 3.81,38.1 v4.45,38.1 | 10.16,37.78 10.16,37.41 9.91,37.24
  Top 1.016: 10.16,38.15 10.16,39.69
  Top 1.27: 5V.1 3.17,68.26 4.45,68.26 7.62,70.48 C62.+ 9.84,72.07 JP3.20
  Top 1.422: L1.P$1 9.21,43.18 10.48,41.91 v10.45,40.2
  Route15 0.813: v4.45,38.1 5.09,39.13 7.16,39.12 9.28,39.13 v10.16,38.1
  Route15 1.422: v10.45,40.2 5.4,41.91 2.86,43.5 2.54,43.81 2.54,44.45 4.42,46.97 4.45,49.21 4.45,58.1 2.22,65.72 5V.1
  Bottom 0.61: v10.16,35.56 10.08,36.09 10.08,36.63 v10.16,38.1
  Bottom 1.27: 5V.1 2.22,67.31 2.22,62.87 2.22,62.17 IC4.3 | 10.79,73.03 C61.1
  Bottom 1.422: C61.1 9.82,73
  Bottom 1.676: JP3.20 10.79,73.03
A0  (via drill 0.25)
  Top 0.254: IC3.10 20.52,42.67 20,43.18 v19.13,44.03
  Bottom 0.254: v19.13,44.03 R36.1
A1  (via drill 0.25)
  Top 0.254: IC3.11 21.02,43.12 v20.03,44.16
  Bottom 0.254: v20.03,44.16 R40.1
A2  (via drill 0.25)
  Top 0.254: IC3.12 21.52,43.42 v21.03,44.13
  Bottom 0.254: v21.03,44.13 R42.1
A3  (via drill 0.25)
  Top 0.254: IC3.13 22.02,42.97 22,43.76 v21.96,44.16
  Bottom 0.254: v21.96,44.16 R41.1
A4  (via drill 0.25)
  Top 0.254: IC3.14 22.52,42.84 22.54,43.5 22.54,43.61 v22.89,44.58
  Bottom 0.254: v22.89,44.58 23.5,45.47 R43.1
A5  (via drill 0.25)
  Top 0.254: IC3.15 23.02,42.7 23.08,43.34 23.32,43.95 v23.81,44.45
  Bottom 0.254: v23.81,44.45 24.45,45.47 R44.1
A6  (via drill 0.25)
  Top 0.254: v32.16,47.5 31.85,47.68 31.75,47.78 31.75,49.01 32.45,49.66 33.27,50.14 33.31,50.14 IC3.50
  Bottom 0.254: R45.1 31.32,47.83 v32.16,47.5
A7
  Top 0.254: R46.1 37.07,51.68 37.06,51.64 36.78,51.64 IC3.53
A8
  Top 0.254: R47.1 37.2,52.39 36.75,52.12 35.46,52.12 IC3.54
A9
  Top 0.254: IC3.55 36.46,52.64 36.64,52.63 37.11,53.02 R48.1
A10
  Top 0.254: IC3.56 36.47,53.14 36.97,53.56 R49.1
A11
  Top 0.254: IC3.57 35.44,53.65 36.32,53.65 36.87,54.14 R50.1
A12
  Top 0.254: R51.1 26.52,63.96 IC3.87
AGND  (via drill 0.25, 0.6)
  Top 0.254: IC3.31 31,40.17 31,38.92 C65.2 31.18,37.68 31.96,36.89 | 31.96,36.89 32,36.89 32.7,36.2 C6.2 33.45,36.09 33.66,35.88 34.55,35.88 C64.2 | 31.96,36.89 v30.87,36.84 | 21.9,26.34 21.9,26.62 C70.2 | C71.2 10.39,34.8 10.96,34.44 10.87,34.35 | C73.2 4.43,23.17 | C74.2 4.45,19.37 v4.45,19.58 | C75.2 42.44,15.49 v42.86,15.88
  Top 0.305: C50.2 v42.86,15.88 | IC5.21 21.9,26.34 20.95,25.4 v20.95,24.13 | 20.95,23.5 21.27,23.18 22.12,23.18 C31.2 | 29.21,18 C22.2 | C28.2 29.31,16.93 29.53,17.14 32.07,17.14 32.38,17.46 IC1.11 34.61,17.46 35.19,17.46 | 35.19,13.52 C51.2 | C9.2 21.09,19.88 20.38,19.18 16.82,19.18 16.14,18.5 15.89,18.5 C26.2 | 35.19,18 v35.48,18.39 | 18.66,32.28 IC5.13 | 4.57,36.09 IC8.5 IC8.PAD | v11.3,36.26 10.84,36.43 IC9.5 IC9.PAD
  Top 0.406: C11.2 16.09,11.53 | 16.09,11.53 v16.31,10.81 | v16.31,10.81 16.46,10.53 16.51,9.95 R19.1 | C26.2 v15.24,17.14 | 16.09,11.53 v16.31,10.81 | 35.19,13.52 35.19,17.46 35.19,18 | 11.43,36.2 v11.3,36.26 11.43,36.51 | 18.41,31.43 18.66,32.28 | 4.57,36.09 v5.17,35.93 | 31.96,36.89 31.93,36.89 32.46,36.16 33.07,36.16 | 34.48,36.18 C64.2
  Top 0.61: v1.26,9.99 1.27,9.53 1.37,8.89 C4.2 | v35.24,20.64 36.02,20.64 C35.- | AGND2.1 4.39,24.84 | 4.39,24.84 4.43,23.17 IC6.2 | 4.39,24.84 4.13,25.72 4.13,26.35 | C46.2 v9.84,21.91 | v1.91,14.92 C25.2
  Top 0.635: 20.95,23.5 v20.95,24.13
  Top 0.813: C8.2 C31.2 | 21.27,23.18 21.27,20.82 C9.2 | v5.17,35.93 5.14,35.56 5.17,34.42 4.88,33.47 | v11.3,36.26 11.43,36.2 | 18.1,31.11 18.41,31.43 | 29.21,18 v29.21,17.14 | v29.21,17.14 29.21,16.83 v29.21,17.14
  Top 1.016: R27.1 19.68,1.91 JP2.4 | JP2.3 21.59,7.62 19.37,9.84 18.41,9.84 | 18.41,9.84 R19.1 | C24.- 18.41,9.84 | C54.- 10.48,2.54 v8.57,2.54 | C3.- 10.33,29.02 C34.2 15.6,29.01 C33.2 R3.2 16.51,30.48 v17.46,31.11 18.1,31.11 | 10.07,31.4 C2.2 | C40.2 4.88,33.47 | 9.84,33.34 C1.2 10.2,33.9 10.87,34.35 11.43,34.92 11.43,36.2
  Top 1.27: C3.- 10.07,31.4 | 4.13,26.35 4.16,26.54 4.45,27.94 C45.- C41.2 4.88,33.47 | 9.84,33.34 C2.2 | 4.39,24.84 4.13,25.72
  Route2 0.254: v30.87,36.84 31.04,36.91 | v4.45,19.58 4.39,20.09
  Route2 0.305: v42.86,15.88 43.18,15.88 | v35.48,18.39 35.56,20.32 v35.24,20.64 | 8.38,36.84 8.43,36.6 | v20.95,24.13 21.27,24.13
  Route2 0.61: 4.13,25.72 4.45,26.67 | v1.26,9.99 1.27,13.97 v1.91,14.92
  Route2 0.813: v5.17,35.93 6.31,36.3 6.55,36.4 7.94,36.83 8.38,36.84 10.15,36.69 v11.3,36.26 | v29.21,17.14 29.84,17.14
  Route2 1.016: v8.57,2.54 10.48,1.91 | v17.46,31.11 16.83,31.11
  Bottom 0.254: C72.2 3.35,33.98 3.94,33.68 4.42,33.81 5.09,34.17 v5.17,35.93
  pour Route2 (isolate 0.635, rank 2): 0.64,37.15 9.84,37.15 12.7,30.8 28.26,30.8 30.48,33.97 30.48,39.05 30.8,39.37 36.83,39.37 42.23,42.86 42.55,59.69 47.31,59.69 47.31,26.99 41.91,26.99 41.91,22.23 49.53,22.23 49.53,0 0,0
AQ0  (via drill 0.25)
  Top 0.254: v19.53,45.95 19.05,46.35 19.05,47.94 19.05,50.16 18.03,51.08 18.11,51.82 18.72,52.22 18.69,53.24 18.69,54.1 19.48,55.19 v20.02,55.4
  Bottom 0.254: R36.2 v19.53,45.95 | v20.02,55.4 21.16,55.5 22.84,55.5 25.4,55.55 26.16,55.58 27.36,55.65 27.99,55.65 28.57,55.88 29.16,56.13 29.26,56.77 29.36,57.51 30.02,58.42 30.2,59.16 IC2.23
AQ1  (via drill 0.25)
  Route3 0.254: v20.62,45.95 21.2,46.62 22.62,46.89 23.18,47.31 23.39,47.71 25.43,48.95 27.62,49.53 30.58,53.15 30.66,54.38 31.52,54.69 32.21,55.07 35.15,55.07 37.31,53.75 37.9,53.77 39.8,53.9 41.38,55.17 42.47,55.91 46.25,55.88 46.89,56.36 47.09,56.69 47.09,61.77 46.79,63.25 45.87,63.58 42.44,63.55 40.59,63.42 38.73,63.3 v37.87,63.65
  Bottom 0.254: R40.2 v20.62,45.95 | v37.87,63.65 37.95,64.54 37.26,65.1 36.63,65.42 32.93,65.42 31.04,63.3 30.76,62.36 IC2.24
AQ2  (via drill 0.25)
  Top 0.254: v19.38,53.37 19.48,52.83 20.45,52.02 20.6,50.83 23.39,48.77 23.29,47.35 22.73,46.99 21.79,46.63 v21.57,45.95
  Bottom 0.254: R42.2 v21.57,45.95 | IC2.25 31.65,59.56 31.8,59 31.17,58.57 30.68,58.37 29.82,57.2 29.59,55.73 28.17,55.14 25.04,55.02 21.67,54.91 20.8,54.56 19.48,53.9 v19.38,53.37
AQ3  (via drill 0.25)
  Route3 0.254: v12.76,66.73 12.7,68.9 v12.7,71.12
  Route14 0.254: v22.48,46 22.66,46.91 23.18,47.31 23.42,47.65 23.82,48.18 23.98,49.3 24.61,50.65 24.69,52.17 25.02,52.53 25.43,53.52 25.36,55.93 24.45,56.52 22.23,57.15 20,57.78 20,59.05 20,60.01 18.73,60.96 18.1,63.82 18.1,66.04 17.46,66.67 v12.76,66.73 | v33.76,59.46 34.98,62.64 35.37,63.74 35.55,64.55 35.73,65.82 35.67,67.16 35.79,69.25 35.88,72.71 35.24,73.66 18.41,73.66 13.34,73.66 12.7,73.03 v12.7,71.12
  Bottom 0.254: R41.2 v22.48,46 | IC2.26 32.56,59.92 33.22,59.74 v33.76,59.46
AQ4  (via drill 0.25)
  Route3 0.254: v31.8,51.94 29.65,48.88 29.53,47.94 29.21,47.62 28.57,47.62 27.94,47.8 27.27,47.8 26.67,47.31 24.77,47.31 v24.13,47.31
  Bottom 0.254: IC2.29 32.38,50.19 32.38,51.75 32.07,52.07 v31.8,51.94 | v24.13,47.31 R43.2
AQ5  (via drill 0.25)
  Route3 0.254: v32.7,52.55 33.48,51.21 32.8,50.48 31.13,49.45 30.21,48.59 30.16,47.62 29.53,46.99 29.21,46.99 v27.43,46.97
  Bottom 0.254: IC2.30 31.75,50.2 31.75,51.12 31.48,51.31 31.11,51.44 30.8,51.75 30.8,52.07 30.8,52.39 31.62,52.65 v32.7,52.55 | v27.43,46.97 27.24,46.61 R44.2
AQ6
  Bottom 0.254: IC2.31 30.8,50.05 30.8,48.59 30.63,48.07 30.63,47.87 R45.2
AQ7  (via drill 0.25)
  Top 0.254: R46.2 38.1,51.77 v38.43,51.84
  Route14 0.254: v38.43,51.84 37.24,51.71 34.98,50.75 33.38,50.06 32.16,49.4 30.45,48.82 v28.63,48.36
  Bottom 0.254: v28.63,48.36 30.07,48.97 30.07,48.95 IC2.32
AQ8  (via drill 0.25)
  Top 0.254: R47.2 38.2,52.53 38.71,52.53 39.01,52.7 39.4,52.78 39.73,52.88 40.84,55.09 41.3,56.01 v41.2,56.84
  Bottom 0.254: v41.2,56.84 40.46,57.02 38.56,57 38.05,57.12 37.08,57.12 36.7,56.95 36.63,56.84 35.8,55.91 35.56,54.93 33.73,53.42 33.15,53.42 32.08,53.19 31.38,53.15 30.37,52.87 29.31,51.12 IC2.33
AQ9  (via drill 0.25)
  Top 0.254: R48.2 38.58,53.16 39.34,53.44 v40.06,55.22
  Route3 0.254: v40.06,55.22 39.47,56.2 37.67,57.2 36.91,57.12 36.02,56.62 32.42,56.69 31.57,57.17 v31.45,57.3
  Bottom 0.254: v31.45,57.3 30.84,57.3 30.63,57.3 30.35,57 30.1,55.58 30.33,54.76 29.36,54.2 29.06,53.56 29.46,52.68 28.88,51.77 28.47,51.42 IC2.34
AQ10  (via drill 0.25)
  Top 0.254: R49.2 38.58,53.8 38.94,53.95 v39.09,54.81
  Route3 0.254: v39.09,54.81 38.71,55.24 38.25,55.6 37.74,55.65 37.13,55.7 36.45,56.13 31.75,56.13 31.09,55.75 30.96,55.73 29.67,55.73 v28.55,56.69
  Bottom 0.254: v28.55,56.69 28.6,56.72 28.51,58.38 28.75,59.56 29.03,59.79 29.26,60.08 IC2.22
AQ11  (via drill 0.25)
  Top 0.254: R50.2 38.32,55.02 37.29,55.02 v36.93,54.91
  Route3 0.254: v36.93,54.91 36.2,55.56 36.07,55.63 31.98,55.63 31.42,55.24 31.06,55.22 29.92,55.04 v28.66,54.46
  Bottom 0.254: v28.66,54.46 27.69,52.32 IC2.35
AQ12  (via drill 0.25)
  Top 0.254: R51.2 26.95,66.45 v27.61,66.83
  Route14 0.254: v27.61,66.83 27.67,66.83 27.64,66.67 27.66,65.96 26.99,60.64 28.21,59.64 28.37,59.23 28.25,58.42 27.86,57.56 27.85,56.1 27.85,54.85 27.9,50.53 v27.3,48.58
  Bottom 0.254: v27.3,48.58 26.82,49.02 IC2.36
BA0-R  (via drill 0.25)
  Top 0.254: R60.2 26.44,66.47 v26.7,67.27
  Bottom 0.254: v26.7,67.27 27.05,67.39 27.3,67.53 27.98,67.55 28.57,66.99 29.39,66.45 29.46,65.84 29.01,63.88 28.57,63.5 27.62,62.55 IC2.20
BA0-S
  Top 0.254: IC3.89 25.52,63.91 25.55,63.99 25.68,64.19 R60.1
BA1-R  (via drill 0.25)
  Top 0.254: v25.77,66.62 25.5,65.84 R61.2
  Route3 0.254: v30.68,67.44 30.48,66.36 28.97,64.96 27.46,65.27 25.96,66 25.81,66.55 v25.77,66.62
  Bottom 0.254: IC2.21 28.47,62.31 29.54,63.5 29.74,63.73 29.82,64.57 30.2,65.33 30.61,66.52 v30.68,67.44
BA1-S
  Top 0.254: IC3.90 25.02,64.05 25.4,64.67 R61.1
CAS-R  (via drill 0.25)
  Top 0.254: R57.2 11.56,49.53 11.48,49.55 v11.28,49.61
  Route3 0.254: v16.79,56.57 17.54,56.87 21.97,56.67 23.75,56.62 v25.35,56.92
  Route14 0.254: v11.28,49.61 11.94,49.84 11.91,50.83 11.94,51.89 11.76,52.55 11.28,53.39 11.11,56.2 11.7,56.71 v16.79,56.57
  Bottom 0.254: v25.35,56.92 25.38,58.74 25.38,59.79 25.25,60.17 IC2.17
CAS-S
  Top 0.254: R57.1 12.95,49.63 13.54,49.63 IC3.132
CKE-R  (via drill 0.25)
  Top 0.254: R52.2 30.33,37.64 30.16,37.48 30.16,36.45 30.48,36.13 v31.11,35.88
  Route14 0.254: v31.11,35.88 31.43,35.88 31.75,36.2 31.43,37.47 29.53,38.73 29.21,39.05 28.89,39.37 28.26,40.01 27.62,40.96 27.14,41.86 26.35,43.5 26.72,45.7 26.34,47.14 26.04,47.94 v26.04,48.26
  Bottom 0.254: v26.04,48.26 26.06,48.28 IC2.37
CKE-S
  Top 0.254: IC3.29 30.02,40.77 30.15,40.64 30.32,40.47 R52.1
CLK-R  (via drill 0.25)
  Top 0.254: R53.2 v23.81,66.52
  Route14 0.254: v23.81,66.52 23.81,59.69 23.9,58.74 25.4,57.78 26.04,57.48 26.04,52.39 v25.4,51.75
  Bottom 0.254: v25.4,51.75 25.27,51.23 IC2.38
CLK-S
  Top 0.254: IC3.93 23.52,64.16 23.53,64.54 R53.1
CS-R  (via drill 0.25)
  Top 0.254: R59.2 29.53,35.97 30.16,35.33 v30.16,35.24
  Route14 0.254: v30.16,35.24 30.16,35.56 29.21,36.83 27.94,39.05 26.35,41.27 25.72,42.55 25.4,44.13 25.72,46.04 25.36,47.92 25.31,48.46 25.82,49.2 26.04,49.53 27.3,50.8 27.3,58.74 v27.48,59.24
  Bottom 0.254: v27.48,59.24 26.99,59.69 26.85,59.83 26.85,59.87 26.86,59.88 IC2.19
CS-S
  Top 0.254: IC3.28 29.52,40.11 R59.1
D0  (via drill 0.25)
  Top 0.254: IC3.85 27.51,61.54 27.51,60.35 28.27,59.59 28.73,58.67 27.34,57.53 26.92,57.02 26.62,56.2 25.86,55.52 25.41,55.42 23.42,56.41 21.69,56.79 21.32,56.93 21.14,57.05 20.52,57.48 v18.9,58.22
  Route3 0.254: v18.9,58.22 19.76,58.95 19.81,60.05 18.97,60.53 17.93,59.92 15.37,61.77 13.77,62.2 13.46,63.17 13.54,65.43 v13.2,65.91
  Bottom 0.254: v13.2,65.91 13.56,65.3 R63.1
D1  (via drill 0.25)
  Top 0.254: IC3.86 27,60.4 26.8,59.61 26.72,58.65 26.72,58.51 26.47,57.58 26.05,56.55 25.58,56.08 25.41,56.06 23.74,56.91 22.04,57.37 21.65,57.49 20.95,58.09 v20.8,58.52
  Route3 0.254: v20.8,58.52 20.3,58.98 20.32,60.22 19.74,61.14 19,61.24 17.98,60.76 15.77,62.28 R64.1 14.26,65.39 v14.19,65.94
  Bottom 0.254: v14.19,65.94 14.26,65.34 R64.1
D2  (via drill 0.25)
  Top 0.254: IC3.114 15.65,58.7 v16.31,59.08
  Route14 0.254: v16.31,59.08 16.38,60.5 16.46,62.23 16.08,62.99 15.62,63.93 v14.96,65.16
  Bottom 0.254: v14.96,65.16 15.24,64.24 R65.1
D3  (via drill 0.25)
  Top 0.254: IC3.115 15.32,58.14 v16.69,58.19
  Route14 0.254: v16.69,58.19 17.27,58.55 17.53,60.25 17.37,62.31 16.66,63.8 v15.54,65.91
  Bottom 0.254: v15.54,65.91 15.75,64.62 16.03,64.01 16.1,63.86 R66.1
D4  (via drill 0.25)
  Top 0.254: IC3.58 34.65,54.13 33.93,54.08 33.6,52.2 33.43,51.59 32.61,50.9 32.05,50.49 31.19,50.52 30.25,50.44 28.32,50.67 27.99,50.88 27.03,51.69 25.73,52.53 24.11,52.45 23.32,52.5 22.62,52.45 21.79,52.39 20.82,52.59 20.18,53.24 20.03,53.96 20.92,55.18 20.94,55.33 20.94,55.97 19.66,57 18.31,57.4 18.01,58.17 17.53,58.73 17.32,59.28 17.53,59.64 17.42,61.14 16.92,61.62 15.8,61.62 15.21,62.03 14.55,62.76 13.26,63.27 v12.09,63.35
  Bottom 0.254: v12.09,63.35 11.81,63.88 11.86,64.77 12.01,65.89 12.06,67.33 12.95,67.56 15.9,66.78 16.26,66.29 16.33,65.3 16.36,64.62 16.66,64.16 R67.1
D5  (via drill 0.25)
  Top 0.254: v33.12,54.12 33.53,54.61 IC3.59
  Bottom 0.254: R68.1 19.84,64.16 19.84,65.76 19.68,66.36 19.37,66.99 19.37,67.94 20.32,68.9 20.32,73.03 21.59,74.93 36.55,74.91 39.59,72.63 40.32,71.12 42.04,66.38 41.91,58.42 41.1,57.66 38.08,57.71 36.41,57.61 35.24,56.52 34.92,55.24 v33.12,54.12
D6  (via drill 0.25)
  Top 0.254: IC3.60 33.73,55.12 32.94,55.12 v32.23,54.2
  Bottom 0.254: v32.23,54.2 32.92,55.24 35.94,58.27 40.86,58.27 41.27,58.74 41.36,62.98 41.06,64.05 40.01,65.33 39.83,70.21 39.46,71.39 39,72.02 36.2,74.3 23.5,74.3 22.86,73.03 22.86,69.22 21.91,68.31 21.77,67.42 20.64,65.72 R69.1
D7  (via drill 0.25)
  Top 0.254: IC3.63 36.27,56.64 36.42,56.64 36.98,57.07 v39.71,59.03
  Bottom 0.254: v39.71,59.03 40.22,59.04 40.51,59.38 40.72,60.22 40.74,62.66 40.4,63.58 39.04,65.04 38.35,66.57 37.8,67.03 37.29,67.36 36.45,67.67 35.55,67.97 33.59,68.17 31.99,68.33 31.14,68.42 30.33,68.48 29.84,68.53 26.16,68.56 25.73,68.75 25.21,68.73 25.04,68.62 24.88,68.61 24.61,68.56 24.03,68.56 23.11,68.61 22.5,68.07 22.33,66.83 R70.1
D8  (via drill 0.25)
  Top 0.254: v23.95,53.26 23.95,53.3 24,53.29 25.04,53.11 26.04,53.16 27.18,52.22 28.19,51.44 30.33,51.28 30.99,51.66 31.01,52.38 30.58,54.08 31.04,54.53 31.55,54.71 32.28,55.27 32.89,55.7 33.93,56.13 34.29,57.1 34.54,57.12 IC3.64
  Route14 0.254: v22.58,47.8 22.8,47.93 22.89,48.36 22.99,48.59 23.14,49.66 24.03,50.93 24.08,52.38 v23.95,53.26
  Bottom 0.254: R71.1 v22.58,47.8
D9  (via drill 0.25)
  Top 0.254: v22.58,53.21 22.9,53.24 23.38,53.99 24.28,54 25.22,53.72 26.09,53.77 27.51,53.37 28.14,53.31 29.03,53.65 29.57,54.51 30.94,55.09 31.88,55.6 32.74,56.19 33.45,56.54 33.96,57.58 34.52,57.63 IC3.65
  Route14 0.254: v21.67,47.42 21.57,47.42 21.79,47.93 21.92,48.62 22.07,49.25 22.38,50.24 22.86,50.75 23.52,51.31 23.57,51.77 23.55,52.12 23.24,52.55 22.86,52.81 22.84,52.86 v22.58,53.21
  Bottom 0.254: R72.1 v21.67,47.42
D10  (via drill 0.25)
  Top 0.254: v21.69,53.35 22.05,53.9 22.68,53.95 23.11,54.59 24.36,54.57 25.3,54.28 25.7,54.33 27.38,54.39 27.84,54.89 28.17,55.14 29.23,55.3 31.22,55.8 31.77,56.13 32.82,56.84 33.66,58.14 IC3.66
  Route14 0.254: v20.75,47.24 20.77,47.3 20.8,47.3 21.11,48.31 21.13,48.79 21.54,50.01 21.79,51.08 22,51.69 21.87,52.38 21.74,52.7 v21.69,53.35
  Bottom 0.254: R73.1 v20.75,47.24
D11  (via drill 0.25)
  Top 0.254: v20.82,53.68 20.95,53.98 21.36,54.43 22.38,54.48 22.76,55.17 22.87,55.22 24.31,55.26 25.36,54.83 26.04,54.93 27.15,55.75 27.5,56.84 28.42,57.56 29.34,57.48 30.5,57.58 31.19,57.99 32.12,58.33 32.85,58.43 33.48,58.65 34.65,58.65 IC3.67
  Route14 0.254: v20.02,46.71 19.93,46.86 19.7,47.27 19.82,47.9 20.38,49.01 20.64,50.8 20.43,51.99 v20.82,53.68
  Bottom 0.254: R74.1 v20.02,46.71
D12  (via drill 0.25)
  Top 0.254: IC3.68 38.2,59.13 v39.83,59.99
  Route3 0.254: v37.15,62.87 36.2,63.18 36.02,63.3 35.38,63.27 34.95,62.76 34.06,61.72 27.91,61.7 26.82,59.84 26.72,58.75 26.21,58.32 25.83,58.19 25.4,58.17 24.61,58.4 23.75,58.32 23.34,58.8 22.68,58.83 v21.84,58.27
  Route14 0.254: v19.74,51.59 19.68,50.47 19.68,49.28 18.95,47.95 18.06,47.55 17.48,47.57 v17.32,47.55
  Bottom 0.254: v39.83,59.99 39.89,60.2 39.36,60.41 37.47,61.59 v37.15,62.87 | v21.84,58.27 20.9,57.58 19.33,56.03 19.13,55.42 18.72,54.46 18.34,53.42 18.67,52.88 v19.74,51.59 | v17.32,47.55 R75.1
D13  (via drill 0.25)
  Top 0.254: v32.6,59.16 31.62,60.3 31.6,60.76 31.52,60.96 IC3.77
  Route3 0.254: v30.61,46.91 30.89,47.9 30.85,48.39 33.15,50.02 34.39,50.57 33.97,52.39 32.96,53.34 32.07,53.34 31.6,53.81 v31.36,53.86
  Route14 0.254: v12.45,45.95 14.02,46.18 15.57,46.51 16.99,46.23 17.45,46.2 17.58,44.93 18.24,44.53 18.39,43.51 19.61,42.93 22.84,41.83 26.76,38.54 27.09,37.5 v27.1,35.41
  Bottom 0.254: R76.1 15.54,47.14 13.39,46.08 v12.45,45.95 | v27.1,35.41 26.52,34.37 25.38,34.39 24.99,35.51 23.82,35.97 21.74,37.26 21.82,40.44 24.71,42.93 25.83,45.77 27.84,45.77 29.63,47.1 v30.61,46.91 | v31.36,53.86 31.25,54.55 31.22,55.27 31.97,56.31 32.56,57.07 32.59,58.61 v32.6,59.16
D14  (via drill 0.25)
  Top 0.254: IC3.78 30.99,60.25 v30.91,59.26
  Route3 0.254: v28.57,52.6 27.94,51.12 27.94,51.03 26.87,50.05 25.04,49.58 22.25,49.05 19.39,49.42 17.83,50.08 17.35,50.63 16.89,50.98 16.59,51.51 16.61,52.17 16.03,52.7 15.04,52.46 15.04,51.84 15.37,49.17 15.29,48.08 14.61,48.01 13.93,47.38 v12.42,47.35
  Route14 0.254: v30.91,59.26 30.89,59 30.73,58.01 30.25,57.1 30.02,56.19 29.79,55.09 29.59,54.66 29.21,53.85 v28.57,52.6
  Bottom 0.254: v12.42,47.35 13.89,47.4 R77.1
D15  (via drill 0.25)
  Top 0.254: v30.91,64.62 30.58,64.26 30.5,63.86 IC3.79
  Route14 0.254: 12.29,67.44 19.53,67.44 20.42,66.57 20.6,66.55 20.88,66.52 21.46,66.78 22.12,66.86 22.39,66.86 22.75,66.97 23.16,67.03 23.67,67.23 24,67.23 24.33,67.03 24.97,67.23 25.67,67.31 26.01,67.46 26.06,67.61 26.44,68.15 27.2,68.12 27.7,67.97 28.85,66.93 30.56,65 v30.91,64.62
  Route14 0.305: v12.42,48.23 12.68,49.02 12.95,49.66 13.16,50.67 13.21,51.41 13.21,52.02 13.41,54.28 v12.52,54.99 | v11.1,59.79 9.27,59.42 7.98,60.15 7.99,62 8.13,62.32 8.24,63.39 8.94,65.08 8.94,67.02 9.93,67.44 12.29,67.44
  Bottom 0.254: R78.1 13.34,48.18
  Bottom 0.305: 13.34,48.18 13.18,48.18 12.9,48.18 v12.42,48.23 | v12.52,54.99 11.71,54.91 11.15,55.4 11.12,58.04 v11.1,59.79
DGND  (via drill 0.25, 0.6, 1)
  Top 0.254: C48.2 24.09,38.88 | 24.09,38.88 23.62,40.16 23.51,40.46 IC3.16 | 37.15,50.63 37.79,50.63 38.26,50.16 40.18,50.19 38.42,50.16 38.42,48.58 38.42,47.94 39.05,48.58 39.37,49.21 39.69,49.85 40.16,50.16 C13.2 40.81,52.88 41.27,53.66 41.59,54.61 | 37.15,50.63 37.03,50.63 IC3.51 | C47.2 39.69,55.98 39.19,55.6 | 39.19,55.6 36.72,55.6 36.35,55.63 35.46,55.63 IC3.61 | C14.2 37.93,42.69 39.05,43.81 v39.05,44.13 | IC3.38 v33.66,44.14 v33.66,44.13 | IC3.130 12.74,50.66 12.47,50.9 v12.47,52.77 12,53.06 10.08,53.06 9.64,51.05 C12.2 | v6.99,46.04 7.3,46.04 R5.2 7.95,46.71 LED2.C | IC3.83 28.52,65.77 C16.2 27.86,65.95 v28.74,65.95 | 39.19,55.6 39.7,55.99 39.78,56.22 v40.49,56.22 | C55.2 v23.32,67.83 | v23.32,67.83 23.18,67.69 v23.32,67.83 | IC3.120 15.29,55.65 15.67,56.08 16.59,55.91 16.92,55.73 17.32,55.98 v17.68,56.05 | IC3.107 16.51,65.15 v17.17,65.85 | IC3.94 23.04,61.37 23.44,59.84 23.44,59 v22.68,57.96 | C66.2 11.76,41.33 v12.12,41.17 | C68.2 37.15,50.64 37.15,50.63 | C69.2 21.78,34.74 21.91,34.61 | C67.2 24.94,39.17 24.09,38.88 | 41.59,54.61 42.23,55.88 | 42.23,55.88 41.91,56.83 | 41.91,56.83 41.91,57.78 | 41.91,57.78 42.55,58.42 41.91,57.78 | 41.91,57.78 41.91,56.83 | 41.91,56.83 42.23,55.88 | 42.23,55.88 41.59,54.61 | 41.59,54.61 v41.15,53.63
  Top 0.305: C20.2 v19.82,37.31 | IC5.2 25.8,34.69 26.04,34.92 v26.12,35.13 | C49.2 22.86,35.56 21.91,34.92 21.91,34.61 IC5.8 | R2.2 v1.91,46.99 | IC7.2 2.54,39.37 1.91,40.01 v1.27,40.01 | v8.26,38.1 8.26,39.24 C37.2
  Top 0.406: LED1.C 7.02,46.18 R5.2 | X2.3 X2.5 43.18,72.71 42.55,72.07 41.27,72.07 40.64,72.71 40.64,73.98 X2.9 40.29,73.94 37.78,71.44 v37.78,68.58
  Top 0.61: C63.2 10.85,64.54
  Top 0.813: C5.2 26.35,36.51 v25.57,36.51 | C15.2 C32.2 | C15.2 C19.2 | C43.2 7.3,62.55 C42.2 9.84,62.87 10.48,63.5 DGND1.1 10.85,64.54 | C15.2 37.78,67.31 v37.78,68.58
  Top 1.016: C49.2 23.5,36.83 v24.13,36.83 C48.2 | R3.1 v15.9,33.57 15.8,32.31
  Top 1.27: C62.- 10.48,68.26 JP3.19 | C43.2 4.76,62.55 C44.- | C36.- 7.66,60.16 v9.53,60.96
  Route2 0.254: v39.05,44.13 38.73,44.13 | v33.66,44.13 33.34,44.45 | 40.32,53.66 v41.15,53.63 41.27,55.24 v40.49,56.22 | v33.97,49.37 33.34,51.12 | v6.99,46.04 6.67,46.35 | v28.74,65.95 28.65,65.96 | v17.17,65.85 17.78,66.99 | v17.68,56.05 17.78,56.2 | v21.01,59.44 20.89,59.82 | v22.68,57.96 23.32,59 23.29,59 | v12.12,41.17 11.43,41.33 11.35,41.25
  Route2 0.305: v19.82,37.31 19.19,37.31 | v26.12,35.13 26.2,35.17 26.19,35.17 | v1.91,46.99 1.91,47.55 | v1.27,40.01 6.03,40.01 v8.26,38.1 | v12.47,52.77 12.65,51.49 12.7,51.44
  Route2 0.406: v18.83,51.47 18.73,46.04 17.46,46.04 v18.24,45.36 | v22.86,51.75 22.86,52.07 | v1.7,50.14 1.59,49.85 | JP5.5 44.13,24.77 44.77,24.77 49.21,24.77 49.53,25.08 49.53,27.62 49.53,27.94 48.9,28.57
  Route2 0.61: v37.05,64.14 37.23,65.15
  Route2 0.813: v25.57,36.51 24.77,36.51 v24.13,36.83 | v9.53,60.96 10.48,63.18 DGND1.1 | v37.78,68.58 37.47,68.58 37.15,68.9
  Route2 1.016: v15.9,33.57 15.88,33.55
  Route2 1.422: DGND1.1 10.48,68.26
  Bottom 0.254: IC2.28 33.26,49.55 v33.97,49.37 C78.2 | IC2.54 12.46,49.61 12.48,49.2 11.37,48.69 | 11.37,48.69 C60.2 11.37,48.69 | IC2.52 14.06,51.34 13.97,51.44 12.52,51.44 v12.47,52.77 | 23.02,65.88 23.5,65.72 C58.2 24.43,64.82 C76.2 | 23.02,65.88 23.04,66.85 | 23.04,66.85 v23.32,67.83 23.04,66.85 | 23.04,66.85 22.99,66.45 23.02,65.88 | v17.17,65.85 C56.2 18.73,65.41 C80.2 | IC2.12 21.26,59.77 v21.01,59.44 | IC2.6 16.46,59.92 17.12,59.33 17.4,58.6 17.75,58.05 v17.68,56.05 | C77.2 C7.2 | C79.2 34.61,64.14 | 30.16,46.35 28.26,44.77 26.99,43.81 26.04,42.86 24.77,41.59 Q1.2
  Bottom 0.305: 28.51,38.59 C18.2 | 24.77,41.59 24.13,40.96 C17.2 23.39,40.54 22.86,40.01 22.86,38.1 v24.13,36.83 | 25.38,41.59 Q1.2 | Q1.4 27.77,39.22 | 12.48,49.2 12.38,49.59 12.5,49.71 12.5,50.09 IC2.54 v12.47,52.77
  Bottom 0.406: IC2.46 18.86,51.62 v18.83,51.47 | v18.24,45.36 18.4,46.15 C59.2 | IC2.41 v22.86,51.75 | 11.37,48.69 12.48,49.2 | X1.P6 2.48,50.42 2.16,50.42 v1.7,50.14
  Bottom 0.61: DGND1.1 C7.2 | 27.94,38.73 28.36,38.84 C18.2 | C57.2 34.61,64.14 35.88,64.14 v37.05,64.14
  Bottom 0.813: v25.57,36.51 27.06,36.52 27.62,37.15 27.94,37.78 27.94,38.73 27.77,39.22
  Bottom 1.27: 10.79,69.85 8.89,70.17 C61.2 | IC4.1 7.66,62.39 8.5,63.23
  Bottom 1.422: JP3.19 10.79,69.85 DGND1.1 10.48,64.14 8.89,64.14 8.5,63.23 8.5,63.26
  pour Route2 (isolate 0.457): 0,76.2 49.53,76.2 49.53,23.18 42.86,23.18 42.86,26.35 48.26,26.35 48.26,61.28 41.27,61.28 41.27,43.81 36.2,40.64 29.84,40.64 29.21,40.01 29.21,34.61 27.62,32.07 13.65,32.07 10.48,38.42 0.64,38.73
DQ0
  Bottom 0.254: IC2.2 13.28,61.95 13.54,62.41 R63.2
DQ1
  Bottom 0.254: IC2.4 14.86,62 14.4,62.48 R64.2
DQ2
  Bottom 0.254: R65.2 15.39,62.64 15.67,62.31 IC2.5
DQ3
  Bottom 0.254: R66.2 16.33,62.66 17.25,62.18 IC2.7
DQ4
  Bottom 0.254: R67.2 17.42,62.81 18.01,62.53 IC2.8
DQ5
  Bottom 0.254: R68.2 IC2.10
DQ6
  Bottom 0.254: R69.2 20.45,62.31 IC2.11
DQ7
  Bottom 0.254: R70.2 22.07,62.05 IC2.13
DQ8
  Bottom 0.254: IC2.42 R71.2
DQ9
  Bottom 0.254: IC2.44 20.5,48.92 R72.2
DQ10
  Bottom 0.254: 19.68,50.09 IC2.45 19.66,48.92 R73.2
DQ11
  Bottom 0.254: IC2.47 18.1,50.08 18.06,49.2 19.18,48.41 R74.2
DQ12
  Bottom 0.254: 17.25,50.1 IC2.48 17.25,49.2 R75.2
DQ13
  Bottom 0.254: IC2.50 R76.2
DQ14
  Bottom 0.254: IC2.51 14.92,50.05 14.86,49.02 R77.2
DQ15
  Bottom 0.254: IC2.53 13.34,50.04 R78.2
FB
  Top 0.406: IC7.4 3.49,42.96 R1.2 R2.1
FILT_A
  Top 0.305: C31.1 22.55,25.3 IC5.22 22.54,28.49 22.54,28.57 22.54,28.89
  Top 0.406: 32.9,26.62 31.43,27.3 29.21,27.3 27.3,29.21 22.86,29.21 22.54,28.89
  Top 0.61: C35.+ 32.9,26.62
I2C2_SCL  (via drill 0.25)
  Top 0.254: IC5.11 19.95,34.98 19.37,35.56 18.1,35.56 17.46,36.2 16.51,36.2 16.19,36.51 14.08,36.89 v12.38,37.16 | IC3.69 38.05,59.64 40.64,61.91 41.27,63.82 JP1.2
  Top 0.305: R10.2 41.42,66.93 41.67,66.47 42.86,64.77 JP1.2 | JP1.2 43.17,64.78 JP1.2
  Route14 0.254: v12.38,37.16 19.05,36.83 24.77,33.66 26.99,33.66 27.62,33.02 35.88,32.38 41.91,30.48 46.35,30.48 48.58,32.7 48.58,62.23 47.31,63.5 44.45,63.5 JP1.2
I2C2_SDA  (via drill 0.25)
  Top 0.254: IC5.12 19.3,34.67 19.05,34.92 17.78,34.92 17.14,35.56 16.19,35.56 15.88,35.88 14.07,36.01 v12.76,36.09 | IC3.70 37.59,60.14 v39.85,62.52
  Top 0.305: R11.2 48.26,64.77 47.09,64.87 45.82,64.87 JP1.1
  Route14 0.254: v12.76,36.09 14.07,36.03 19.05,35.88 22.23,34.29 24.13,33.02 26.67,33.02 27.3,32.38 35.56,31.43 41.59,27.62 46.67,27.62 49.53,30.8 49.53,62.55 47.31,64.77 JP1.1 45.72,65.41 44.77,66.36 42.86,66.36 41.5,65.09 40.32,63.5 v39.85,62.52
LD-R  (via drill 0.25)
  Top 0.254: R55.2 11.81,45.14 v11.28,43.2
  Route3 0.254: v16,57.42 17.46,57.47 22.23,57.15 23.7,57.15 v24.45,57.47
  Route14 0.254: v11.28,43.2 10.16,44.13 10.16,45.4 10.48,46.35 10.48,49.21 10.16,49.85 10.16,50.8 10.15,51.58 10.12,56.53 11.43,57.47 v16,57.42
  Bottom 0.254: v24.45,57.47 24.21,57.47 23.72,57.68 23.7,59.38 IC2.15
LD-S
  Top 0.254: IC3.141 13.16,45.14 R55.1
N$2  (via drill 0.6)
  Top 0.305: v24.13,24.45 24.45,24.45 23.85,25.95 23.85,26.11 23.85,26.16 IC5.24
  Top 0.406: R22.1 12.17,23.39 12.38,23.18 13.02,23.5 14.61,24.77 16.51,24.77 v17.14,25.4
  Bottom 0.406: v17.14,25.4 21.59,25.4 v24.13,24.45
N$3
  Top 0.254: R14.2 33.02,64.59 IC3.74
N$4
  Top 0.254: R15.2 31.97,65.33 32,64.57 IC3.76
N$5
  Top 0.254: R79.2 9.14,48.74 9.12,48.72 LED2.A
N$6
  Top 0.254: IC3.134 13.23,48.64 12.57,48.92 12.01,48.92 R79.1
N$7
  Top 0.305: IC1.7 40.01,19.37 41.27,20.64 41.59,20.95 42.65,20.95
  Top 0.406: 42.65,20.95 C39.1 43.02,20.85 42.94,20.78 43.26,20.82 44.56,20.85 R33.1
N$9  (via drill 0.25)
  Top 0.254: R35.2 v12.06,55.88
  Route3 0.254: v12.06,55.88 11.11,54.93 10.79,54.29 10.16,53.66 4.45,53.66 3.49,54.29 2.22,54.29 v1.91,54.29
  Bottom 0.254: v1.91,54.29 2.22,54.29 X1.P3
N$10  (via drill 0.25)
  Top 0.254: R34.2 11.91,59.46 11.86,59.44 11.46,59.11 10.64,58.62 10.45,58.53 10.11,58.17 8.26,56.2 6.99,56.2 v1.91,56.2
  Bottom 0.254: v1.91,56.2 1.59,55.88 1.59,55.24 3.06,54.83 X1.P2
N$11  (via drill 0.25)
  Top 0.254: R9.2 v10.9,60.81
  Bottom 0.254: v10.9,60.81 10.12,59.69 4.76,59.69 3.81,59.05 X1.P1
N$12  (via drill 0.25)
  Top 0.254: R39.2 v20.7,67.33
  Route14 0.254: v20.7,67.33 19.94,68.05 8.31,68.02 6.67,67.63 4.61,67.11 1.91,60.64 2.86,56.83 2.86,54.29 3.49,53.34 3.49,48.58 | 3.49,48.58 3.49,47.62 | 3.49,48.58 3.49,46.35 v4.76,44.45
  Bottom 0.254: v4.76,44.45 3.81,45.72 X1.P8
N$14  (via drill 0.6)
  Top 0.406: R8.1 R16.1 C11.1 15.9,13.23 v16.22,13.23 | v27.3,22.23 27.94,22.54 28.89,22.54 R7.2
  Bottom 0.406: v16.22,13.23 20.85,13.23 26.04,18.41 26.99,19.37 31.11,19.37 34.29,22.54 34.29,23.5 33.34,24.45 32.38,24.45 31.11,23.18 31.11,22.86 29.53,21.27 27.3,21.27 v27.3,22.23
N$15  (via drill 0.25)
  Top 0.254: R38.2 21.44,67.41 v21.13,68.22
  Route14 0.254: v21.13,68.22 20.64,68.58 13.65,68.58 13.34,68.58 6.67,68.58 3.91,67.87 0.95,60.64 0.95,49.53 v1.59,48.9
  Bottom 0.406: X1.P7 2.01,49.32 v1.59,48.9
N$16  (via drill 0.25)
  Top 0.254: R37.2 11.11,58.1 11.11,54.93 v12.06,53.98
  Route3 0.254: v12.06,53.98 11.81,53.59 10.36,52.73 4.76,52.7 3.49,51.44 2.54,51.44 2.12,51.7 1.93,51.91 1.66,52.15 v1.71,52.65